# EAGLE design CN-Cape004 (EAGLE 7.2.0)

## Sheet 1 of 5: Spannungsversorgung Verpolungsschutz ? Größe der Sicherung ? 1A oder 3A für Servos?
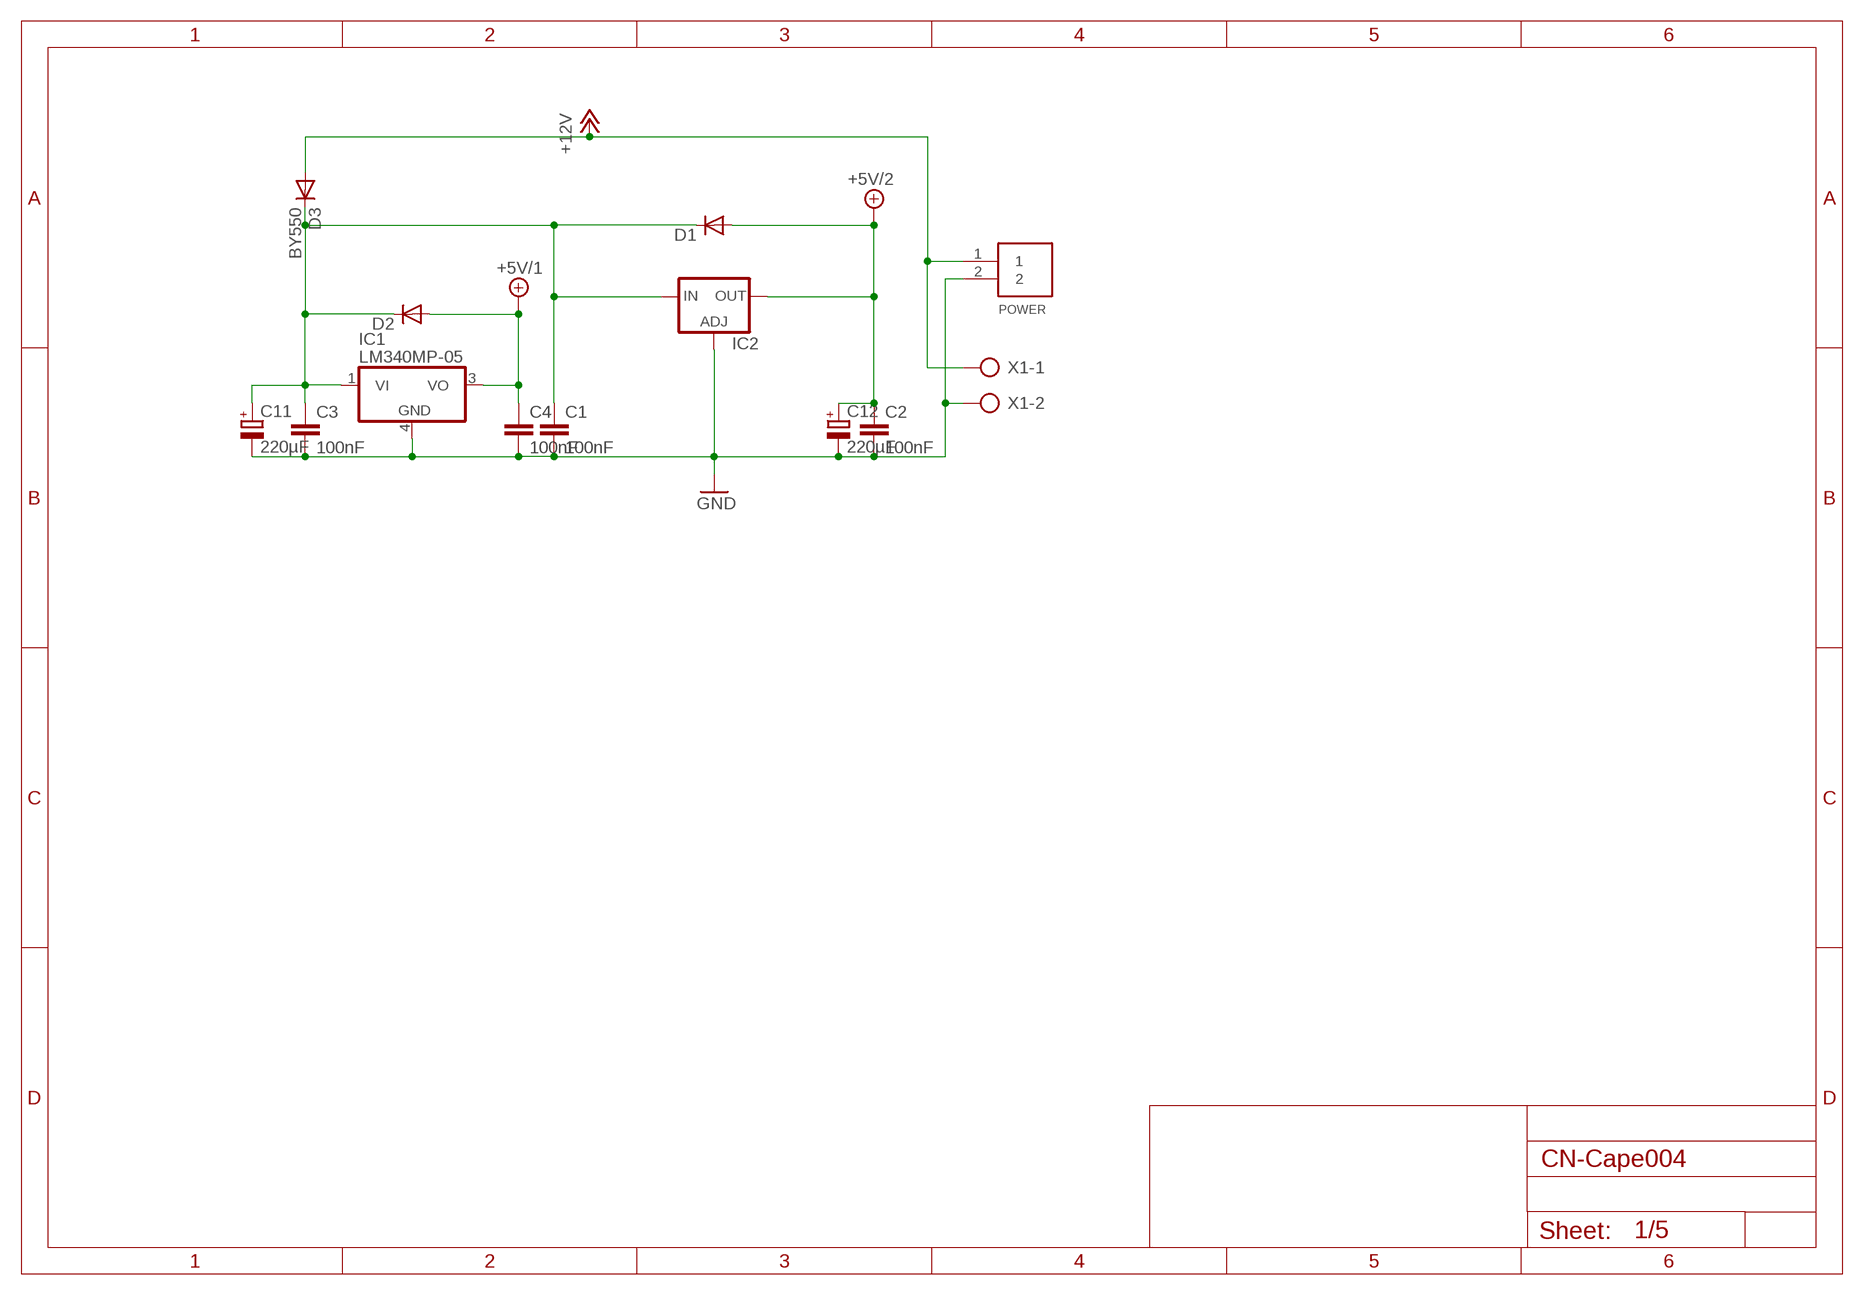
[diagram p0: schematic, sheet 1]

### Parts
C1  100nF  C-EUC0603  [C0603]
C2  100nF  C-EUC0603  [C0603]
C3  100nF  C-EUC0603  [C0603]
C4  100nF  C-EUC0603  [C0603]
C11  220µF  CPOL-EUE3.5-8  [E3,5-8]
C12  220µF  CPOL-EUE3.5-8  [E3,5-8]
D1  DIODE-SOD123  [SOD123]
D2  DIODE-SOD123  [SOD123]
D3  BY550  [DO27-15]
IC1  LM340MP-05  [SOT223]
IC2  LM138-TL  [TO220L1]
POWER  S2PIN  [S2B-EH]
X1  AK500/2-H  [AK500/2-H]

### Nets
12V_FUSED: C1.1 C3.1 C11.+ D1.C D2.C D3.C IC1.1(VI) IC2.3(IN)
+5V/1: C4.1 D2.A IC1.3(VO) ; also sheet 2,3,4,5
+5V/2: C2.1 C12.+ D1.A IC2.2(OUT) ; also sheet 5
+12V: D3.A POWER.1 X1.1
GND: C1.2 C2.2 C3.2 C4.2 C11.- C12.- IC1.4(GND) IC2.1(ADJ) POWER.2 X1.2 ; also sheet 2,3,4,5

## Sheet 2 of 5: BeagleBoard Black Expansion Header
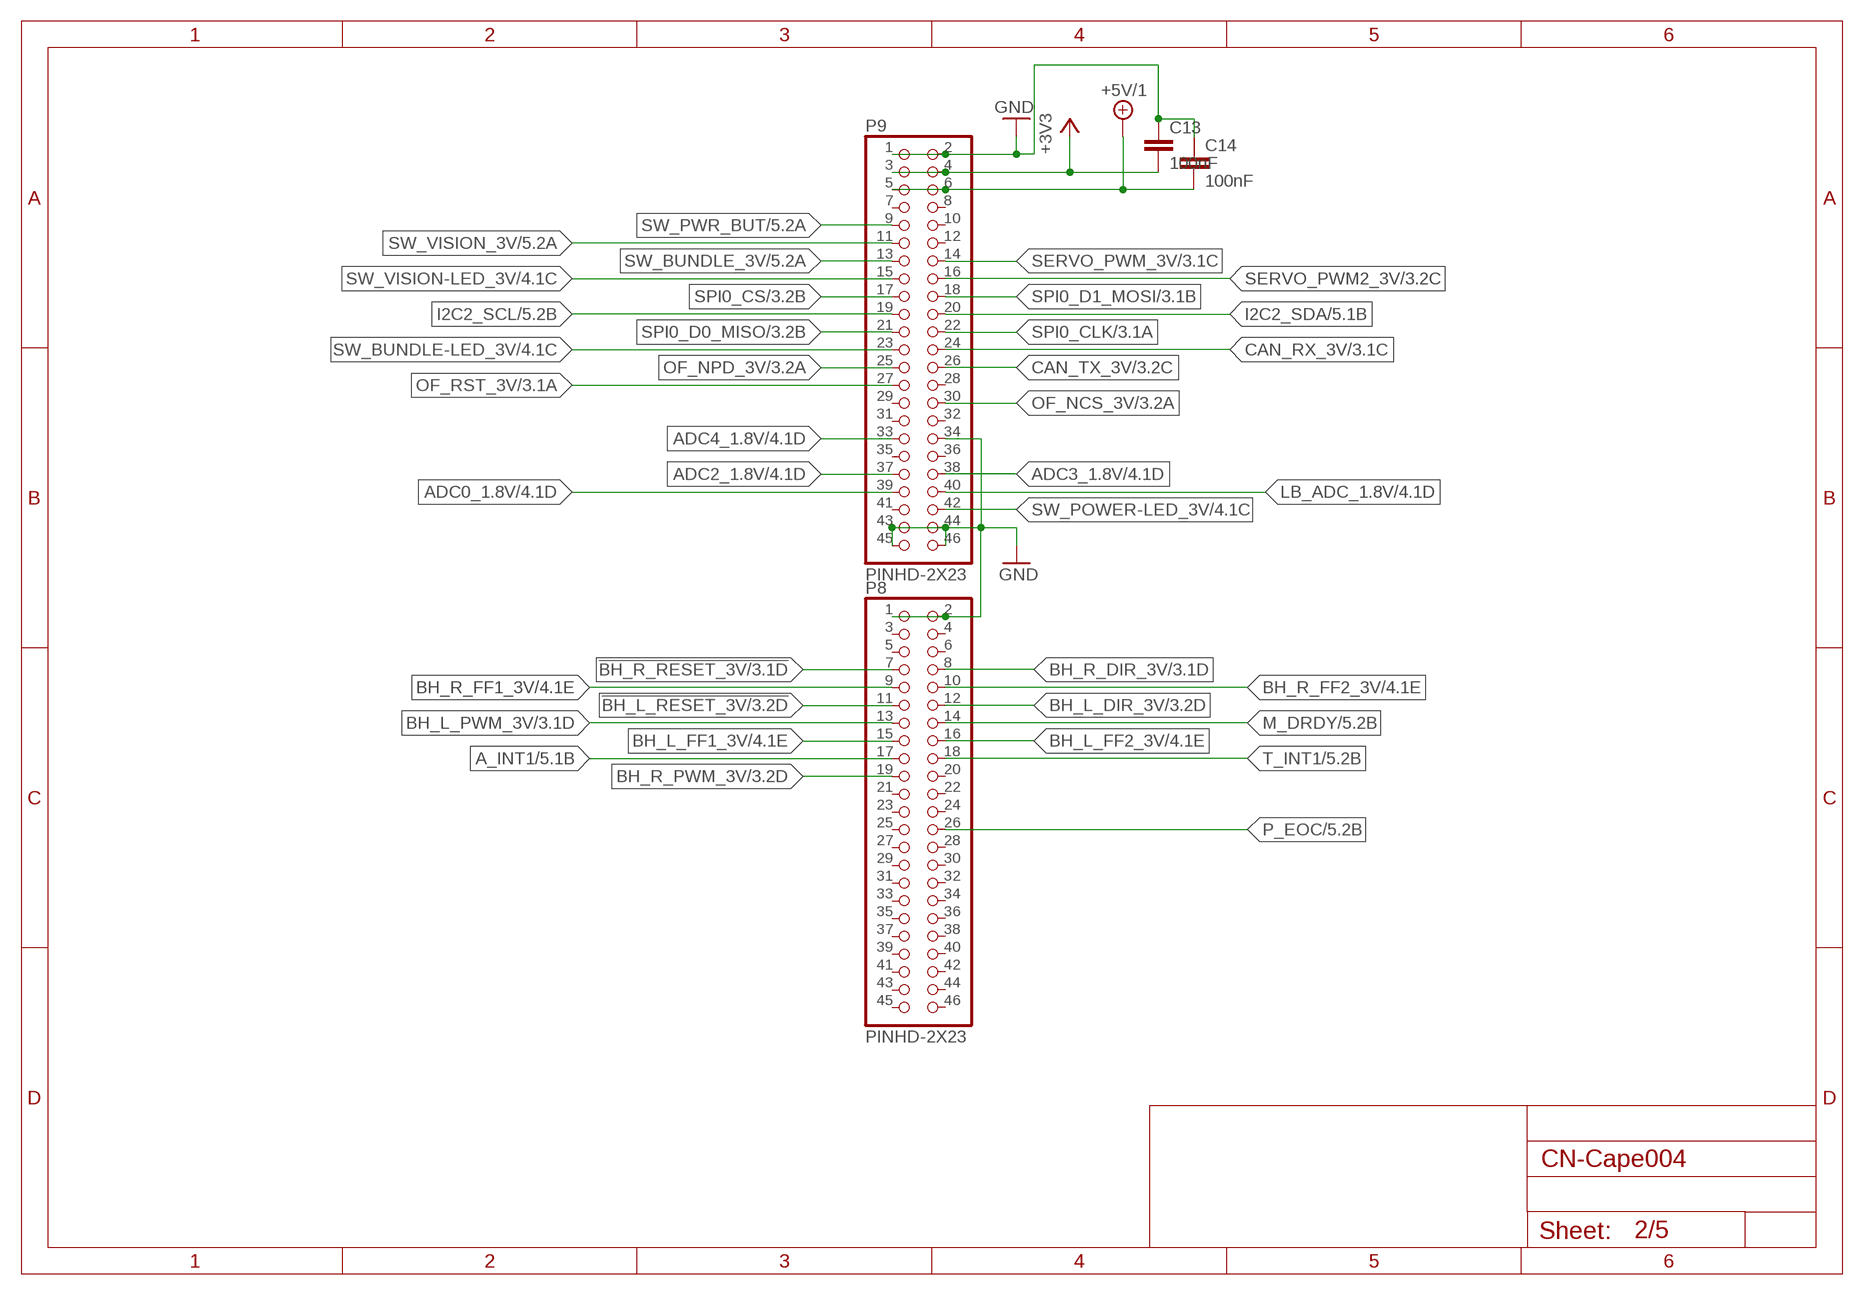
[diagram p1: schematic, sheet 2]

### Parts
C13  100nF  C-EUC0603  [C0603]
C14  100nF  C-EUC0603  [C0603]
P8  PINHD-2X23  [2X23]
P9  PINHD-2X23  [2X23]

### Nets
!BH_L_RESET_3V: P8.11 ; also sheet 3
!BH_R_RESET_3V: P8.7 ; also sheet 3
+3V3: C13.2 P9.3 P9.4 ; also sheet 3,5
+5V/1: C14.2 P9.5 P9.6 ; also sheet 1,3,4,5
A_INT1: P8.17 ; also sheet 5
ADC0_1.8V: P9.39 ; also sheet 4
ADC2_1.8V: P9.37 ; also sheet 4
ADC3_1.8V: P9.38 ; also sheet 4
ADC4_1.8V: P9.33 ; also sheet 4
BH_L_DIR_3V: P8.12 ; also sheet 3
BH_L_FF1_3V: P8.15 ; also sheet 4
BH_L_FF2_3V: P8.16 ; also sheet 4
BH_L_PWM_3V: P8.13 ; also sheet 3
BH_R_DIR_3V: P8.8 ; also sheet 3
BH_R_FF1_3V: P8.9 ; also sheet 4
BH_R_FF2_3V: P8.10 ; also sheet 4
BH_R_PWM_3V: P8.19 ; also sheet 3
CAN_RX_3V: P9.24 ; also sheet 3
CAN_TX_3V: P9.26 ; also sheet 3
GND: C13.1 C14.1 P8.1 P8.2 P9.1 P9.2 P9.34 P9.43 P9.44 P9.45 P9.46 ; also sheet 1,3,4,5
I2C2_SCL: P9.19 ; also sheet 5
I2C2_SDA: P9.20 ; also sheet 5
LB_ADC_1.8V: P9.40 ; also sheet 4
M_DRDY: P8.14 ; also sheet 5
OF_NCS_3V: P9.30 ; also sheet 3
OF_NPD_3V: P9.25 ; also sheet 3
OF_RST_3V: P9.27 ; also sheet 3
P_EOC: P8.26 ; also sheet 5
SERVO_PWM2_3V: P9.16 ; also sheet 3
SERVO_PWM_3V: P9.14 ; also sheet 3
SPI0_CLK: P9.22 ; also sheet 3
SPI0_CS: P9.17 ; also sheet 3
SPI0_D0_MISO: P9.21 ; also sheet 3
SPI0_D1_MOSI: P9.18 ; also sheet 3
SW_BUNDLE-LED_3V: P9.23 ; also sheet 4
SW_BUNDLE_3V: P9.13 ; also sheet 5
SW_POWER-LED_3V: P9.42 ; also sheet 4
SW_PWR_BUT: P9.9 ; also sheet 5
SW_VISION-LED_3V: P9.15 ; also sheet 4
SW_VISION_3V: P9.11 ; also sheet 5
T_INT1: P8.18 ; also sheet 5
Unconnected: P8.3 P8.4 P8.5 P8.6 P8.20 P8.21 P8.22 P8.23 P8.24 P8.25 P8.27 P8.28 P8.29 P8.30 P8.31 P8.32 P8.33 P8.34 P8.35 P8.36 P8.37 P8.38 P8.39 P8.40 P8.41 P8.42 P8.43 P8.44 P8.45 P8.46 P9.7 P9.8 P9.10 P9.12 P9.28 P9.29 P9.31 P9.32 P9.35 P9.36 P9.41

## Sheet 3 of 5: Level Shifter
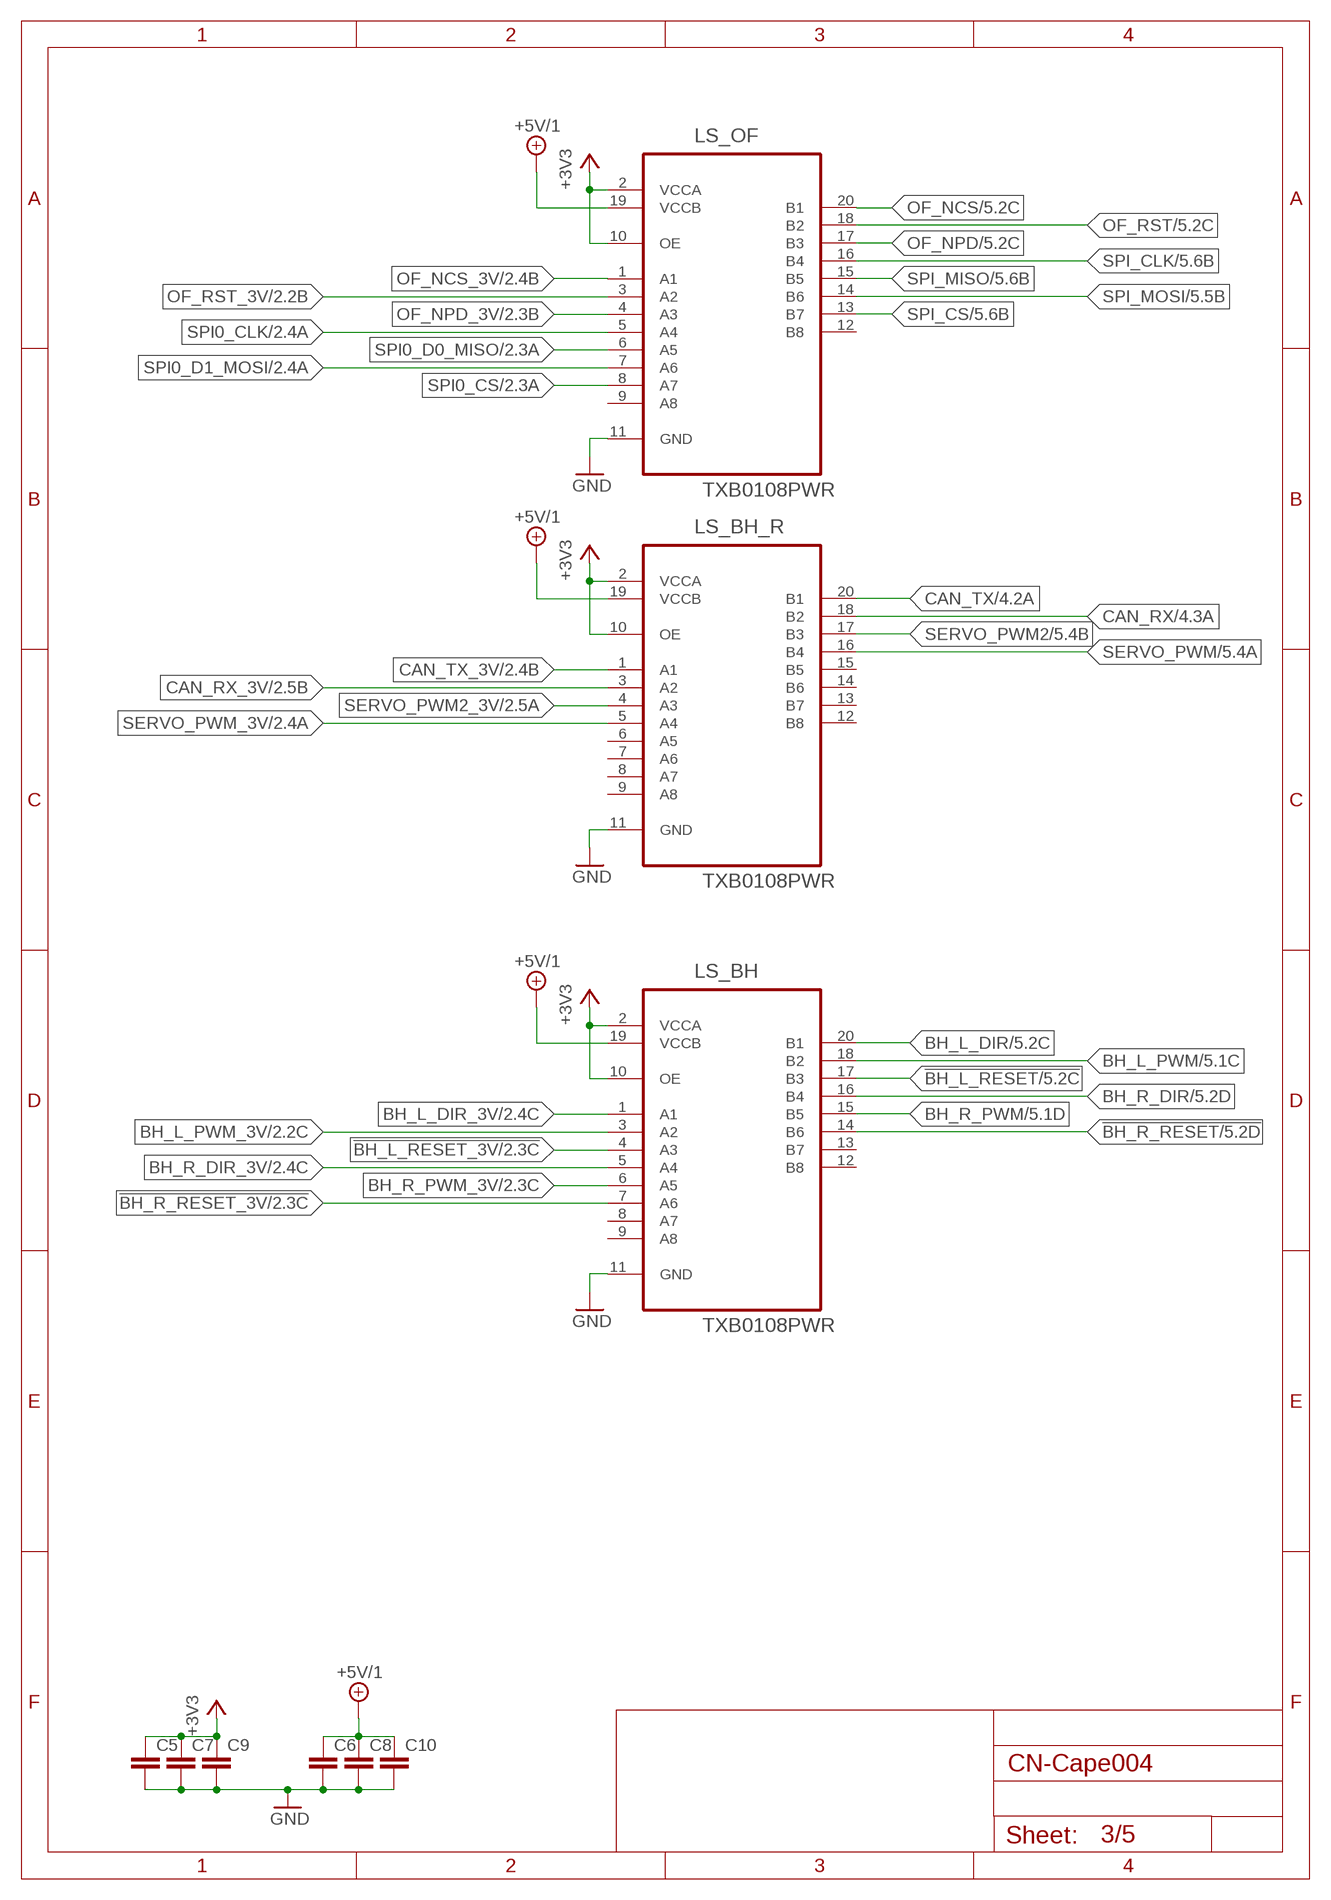
[diagram p2: schematic, sheet 3]

### Parts
C5  C-EUC0603  [C0603]
C6  C-EUC0603  [C0603]
C7  C-EUC0603  [C0603]
C8  C-EUC0603  [C0603]
C9  C-EUC0603  [C0603]
C10  C-EUC0603  [C0603]
LS_BH  TXB0108PWR  [SOP65P640X120-20N]
LS_BH_R  TXB0108PWR  [SOP65P640X120-20N]
LS_OF  TXB0108PWR  [SOP65P640X120-20N]

### Nets
!BH_L_RESET: LS_BH.17(B3) ; also sheet 5
!BH_L_RESET_3V: LS_BH.4(A3) ; also sheet 2
!BH_R_RESET: LS_BH.14(B6) ; also sheet 5
!BH_R_RESET_3V: LS_BH.7(A6) ; also sheet 2
+3V3: C5.1 C7.1 C9.1 LS_BH.2(VCCA) LS_BH.10(OE) LS_BH_R.2(VCCA) LS_BH_R.10(OE) LS_OF.2(VCCA) LS_OF.10(OE) ; also sheet 2,5
+5V/1: C6.1 C8.1 C10.1 LS_BH.19(VCCB) LS_BH_R.19(VCCB) LS_OF.19(VCCB) ; also sheet 1,2,4,5
BH_L_DIR: LS_BH.20(B1) ; also sheet 5
BH_L_DIR_3V: LS_BH.1(A1) ; also sheet 2
BH_L_PWM: LS_BH.18(B2) ; also sheet 5
BH_L_PWM_3V: LS_BH.3(A2) ; also sheet 2
BH_R_DIR: LS_BH.16(B4) ; also sheet 5
BH_R_DIR_3V: LS_BH.5(A4) ; also sheet 2
BH_R_PWM: LS_BH.15(B5) ; also sheet 5
BH_R_PWM_3V: LS_BH.6(A5) ; also sheet 2
CAN_RX: LS_BH_R.18(B2) ; also sheet 4
CAN_RX_3V: LS_BH_R.3(A2) ; also sheet 2
CAN_TX: LS_BH_R.20(B1) ; also sheet 4
CAN_TX_3V: LS_BH_R.1(A1) ; also sheet 2
GND: C5.2 C6.2 C7.2 C8.2 C9.2 C10.2 LS_BH.11(GND) LS_BH_R.11(GND) LS_OF.11(GND) ; also sheet 1,2,4,5
OF_NCS: LS_OF.20(B1) ; also sheet 5
OF_NCS_3V: LS_OF.1(A1) ; also sheet 2
OF_NPD: LS_OF.17(B3) ; also sheet 5
OF_NPD_3V: LS_OF.4(A3) ; also sheet 2
OF_RST: LS_OF.18(B2) ; also sheet 5
OF_RST_3V: LS_OF.3(A2) ; also sheet 2
SERVO_PWM: LS_BH_R.16(B4) ; also sheet 5
SERVO_PWM2: LS_BH_R.17(B3) ; also sheet 5
SERVO_PWM2_3V: LS_BH_R.4(A3) ; also sheet 2
SERVO_PWM_3V: LS_BH_R.5(A4) ; also sheet 2
SPI0_CLK: LS_OF.5(A4) ; also sheet 2
SPI0_CS: LS_OF.8(A7) ; also sheet 2
SPI0_D0_MISO: LS_OF.6(A5) ; also sheet 2
SPI0_D1_MOSI: LS_OF.7(A6) ; also sheet 2
SPI_CLK: LS_OF.16(B4) ; also sheet 5
SPI_CS: LS_OF.13(B7) ; also sheet 5
SPI_MISO: LS_OF.15(B5) ; also sheet 5
SPI_MOSI: LS_OF.14(B6) ; also sheet 5
Unconnected: LS_BH.8(A7) LS_BH.9(A8) LS_BH.12(B8) LS_BH.13(B7) LS_BH_R.6(A5) LS_BH_R.7(A6) LS_BH_R.8(A7) LS_BH_R.9(A8) LS_BH_R.12(B8) LS_BH_R.13(B7) LS_BH_R.14(B6) LS_BH_R.15(B5) LS_OF.9(A8) LS_OF.12(B8)

## Sheet 4 of 5: CAN- Bus & LED Transistoren
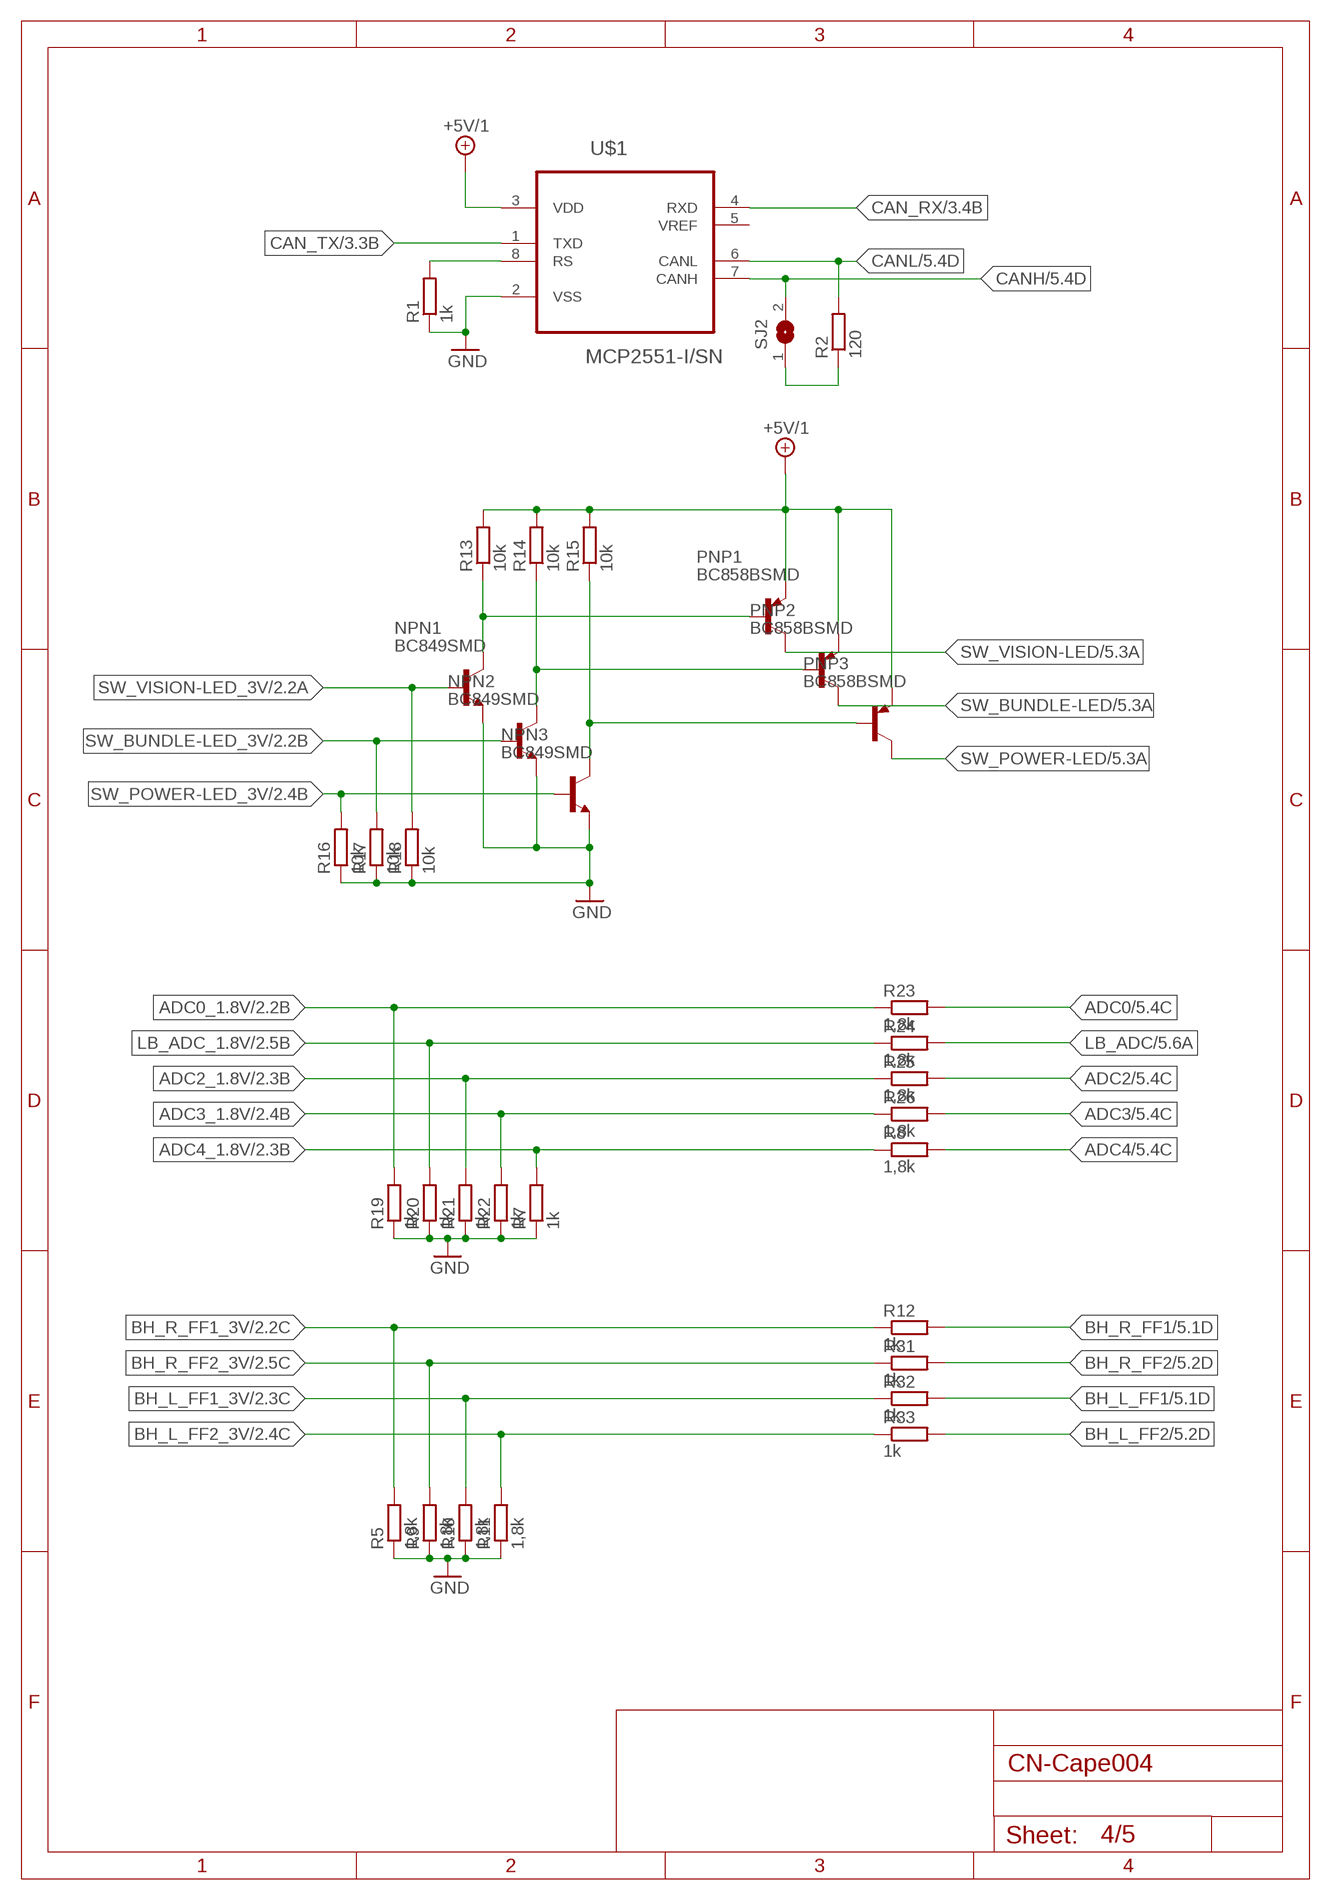
[diagram p3: schematic, sheet 4]

### Parts
NPN1  BC849SMD  [SOT23-BEC]
NPN2  BC849SMD  [SOT23-BEC]
NPN3  BC849SMD  [SOT23-BEC]
PNP1  BC858BSMD  [SOT23-BEC]
PNP2  BC858BSMD  [SOT23-BEC]
PNP3  BC858BSMD  [SOT23-BEC]
R1  1k  R-EU_R0805  [R0805]
R2  120  R-EU_R0805  [R0805]
R5  1,8k  R-EU_R0805  [R0805]
R7  1k  R-EU_R0805  [R0805]
R8  1,8k  R-EU_R0805  [R0805]
R9  1,8k  R-EU_R0805  [R0805]
R10  1,8k  R-EU_R0805  [R0805]
R11  1,8k  R-EU_R0805  [R0805]
R12  1k  R-EU_R0805  [R0805]
R13  10k  R-EU_R0805  [R0805]
R14  10k  R-EU_R0805  [R0805]
R15  10k  R-EU_R0805  [R0805]
R16  10k  R-EU_R0805  [R0805]
R17  10k  R-EU_R0805  [R0805]
R18  10k  R-EU_R0805  [R0805]
R19  1k  R-EU_R0805  [R0805]
R20  1k  R-EU_R0805  [R0805]
R21  1k  R-EU_R0805  [R0805]
R22  1k  R-EU_R0805  [R0805]
R23  1,8k  R-EU_R0805  [R0805]
R24  1,8k  R-EU_R0805  [R0805]
R25  1,8k  R-EU_R0805  [R0805]
R26  1,8k  R-EU_R0805  [R0805]
R31  1k  R-EU_R0805  [R0805]
R32  1k  R-EU_R0805  [R0805]
R33  1k  R-EU_R0805  [R0805]
SJ2  SJ  [SJ]
U$1  MCP2551-I/SN  [SOIC127P600X175-8N]

### Nets
+5V/1: PNP1.E PNP2.E PNP3.E R13.2 R14.2 R15.2 U$1.3(VDD) ; also sheet 1,2,3,5
ADC0: R23.2 ; also sheet 5
ADC0_1.8V: R19.2 R23.1 ; also sheet 2
ADC2: R25.2 ; also sheet 5
ADC2_1.8V: R21.2 R25.1 ; also sheet 2
ADC3: R26.2 ; also sheet 5
ADC3_1.8V: R22.2 R26.1 ; also sheet 2
ADC4: R8.2 ; also sheet 5
ADC4_1.8V: R7.2 R8.1 ; also sheet 2
BH_L_FF1: R32.2 ; also sheet 5
BH_L_FF1_3V: R10.2 R32.1 ; also sheet 2
BH_L_FF2: R33.2 ; also sheet 5
BH_L_FF2_3V: R11.2 R33.1 ; also sheet 2
BH_R_FF1: R12.2 ; also sheet 5
BH_R_FF1_3V: R5.2 R12.1 ; also sheet 2
BH_R_FF2: R31.2 ; also sheet 5
BH_R_FF2_3V: R9.2 R31.1 ; also sheet 2
CAN_RX: U$1.4(RXD) ; also sheet 3
CAN_TX: U$1.1(TXD) ; also sheet 3
CANH: SJ2.2 U$1.7(CANH) ; also sheet 5
CANL: R2.2 U$1.6(CANL) ; also sheet 5
GND: NPN1.E NPN2.E NPN3.E R1.1 R5.1 R7.1 R9.1 R10.1 R11.1 R16.1 R17.1 R18.1 R19.1 R20.1 R21.1 R22.1 U$1.2(VSS) ; also sheet 1,2,3,5
LB_ADC: R24.2 ; also sheet 5
LB_ADC_1.8V: R20.2 R24.1 ; also sheet 2
N$1: NPN1.C PNP1.B R13.1
N$2: NPN2.C PNP2.B R14.1
N$4: NPN3.C PNP3.B R15.1
N$9: R1.2 U$1.8(RS)
N$10: R2.1 SJ2.1
SW_BUNDLE-LED: PNP2.C ; also sheet 5
SW_BUNDLE-LED_3V: NPN2.B R17.2 ; also sheet 2
SW_POWER-LED: PNP3.C ; also sheet 5
SW_POWER-LED_3V: NPN3.B R16.2 ; also sheet 2
SW_VISION-LED: PNP1.C ; also sheet 5
SW_VISION-LED_3V: NPN1.B R18.2 ; also sheet 2
Unconnected: U$1.5(VREF)

## Sheet 5 of 5: Connector
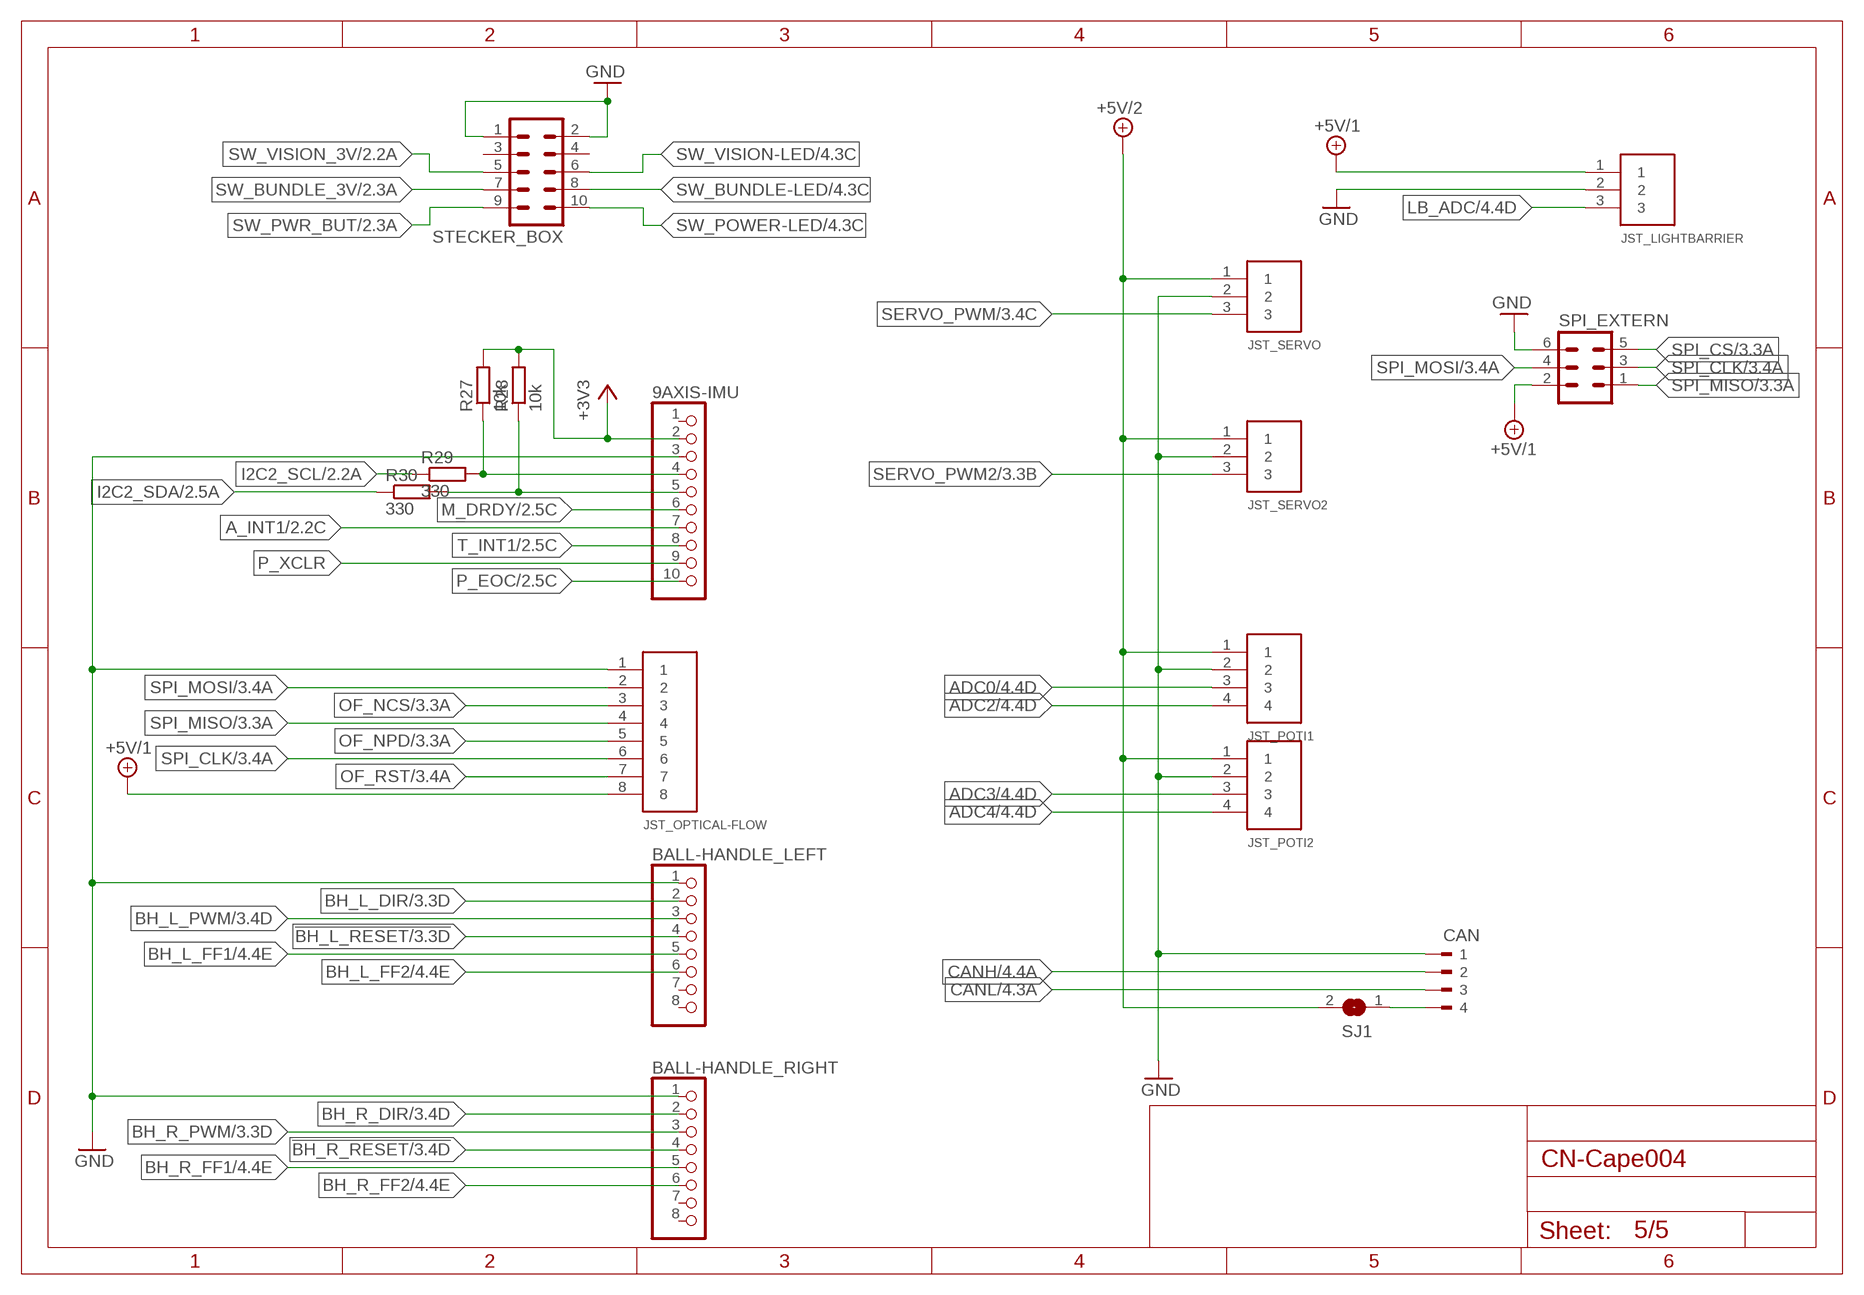
[diagram p4: schematic, sheet 5]

### Parts
9AXIS-IMU  PINHD-1X10  [1X10]
BALL-HANDLE_LEFT  PINHD-1X8  [1X08]
BALL-HANDLE_RIGHT  PINHD-1X8  [1X08]
CAN  90-4  [90-4]
JST_LIGHTBARRIER  S3PIN  [S3B-EH]
JST_OPTICAL-FLOW  S8PIN  [S8B-EH]
JST_POTI1  4PIN  [B4B-EH]
JST_POTI2  4PIN  [B4B-EH]
JST_SERVO  S3PIN  [S3B-EH]
JST_SERVO2  3PIN  [B3B-EH]
R27  10k  R-EU_R0805  [R0805]
R28  10k  R-EU_R0805  [R0805]
R29  330  R-EU_R0805  [R0805]
R30  330  R-EU_R0805  [R0805]
SJ1  SJ  [SJ]
SPI_EXTERN  ML6  [ML6]
STECKER_BOX  ML10  [ML10]

### Nets
5V/2_F&J: CAN.4 SJ1.1
!BH_L_RESET: BALL-HANDLE_LEFT.4 ; also sheet 3
!BH_R_RESET: BALL-HANDLE_RIGHT.4 ; also sheet 3
+3V3: 9AXIS-IMU.2 R27.2 R28.2 ; also sheet 2,3
+5V/1: JST_LIGHTBARRIER.1 JST_OPTICAL-FLOW.8 SPI_EXTERN.2 ; also sheet 1,2,3,4
+5V/2: JST_POTI1.1 JST_POTI2.1 JST_SERVO2.1 JST_SERVO.1 SJ1.2 ; also sheet 1
A_INT1: 9AXIS-IMU.7 ; also sheet 2
ADC0: JST_POTI1.3 ; also sheet 4
ADC2: JST_POTI1.4 ; also sheet 4
ADC3: JST_POTI2.3 ; also sheet 4
ADC4: JST_POTI2.4 ; also sheet 4
BH_L_DIR: BALL-HANDLE_LEFT.2 ; also sheet 3
BH_L_FF1: BALL-HANDLE_LEFT.5 ; also sheet 4
BH_L_FF2: BALL-HANDLE_LEFT.6 ; also sheet 4
BH_L_PWM: BALL-HANDLE_LEFT.3 ; also sheet 3
BH_R_DIR: BALL-HANDLE_RIGHT.2 ; also sheet 3
BH_R_FF1: BALL-HANDLE_RIGHT.5 ; also sheet 4
BH_R_FF2: BALL-HANDLE_RIGHT.6 ; also sheet 4
BH_R_PWM: BALL-HANDLE_RIGHT.3 ; also sheet 3
CANH: CAN.2 ; also sheet 4
CANL: CAN.3 ; also sheet 4
GND: 9AXIS-IMU.3 BALL-HANDLE_LEFT.1 BALL-HANDLE_RIGHT.1 CAN.1 JST_LIGHTBARRIER.2 JST_OPTICAL-FLOW.1 JST_POTI1.2 JST_POTI2.2 JST_SERVO2.2 JST_SERVO.2 SPI_EXTERN.6 STECKER_BOX.1 STECKER_BOX.2 ; also sheet 1,2,3,4
I2C2_SCL: R29.1 ; also sheet 2
I2C2_SDA: R30.1 ; also sheet 2
LB_ADC: JST_LIGHTBARRIER.3 ; also sheet 4
M_DRDY: 9AXIS-IMU.6 ; also sheet 2
OF_NCS: JST_OPTICAL-FLOW.3 ; also sheet 3
OF_NPD: JST_OPTICAL-FLOW.5 ; also sheet 3
OF_RST: JST_OPTICAL-FLOW.7 ; also sheet 3
P_EOC: 9AXIS-IMU.10 ; also sheet 2
P_XCLR: 9AXIS-IMU.9
SCL: 9AXIS-IMU.4 R27.1 R29.2
SDA: 9AXIS-IMU.5 R28.1 R30.2
SERVO_PWM: JST_SERVO.3 ; also sheet 3
SERVO_PWM2: JST_SERVO2.3 ; also sheet 3
SPI_CLK: JST_OPTICAL-FLOW.6 SPI_EXTERN.3 ; also sheet 3
SPI_CS: SPI_EXTERN.5 ; also sheet 3
SPI_MISO: JST_OPTICAL-FLOW.4 SPI_EXTERN.1 ; also sheet 3
SPI_MOSI: JST_OPTICAL-FLOW.2 SPI_EXTERN.4 ; also sheet 3
SW_BUNDLE-LED: STECKER_BOX.8 ; also sheet 4
SW_BUNDLE_3V: STECKER_BOX.7 ; also sheet 2
SW_POWER-LED: STECKER_BOX.10 ; also sheet 4
SW_PWR_BUT: STECKER_BOX.9 ; also sheet 2
SW_VISION-LED: STECKER_BOX.6 ; also sheet 4
SW_VISION_3V: STECKER_BOX.5 ; also sheet 2
T_INT1: 9AXIS-IMU.8 ; also sheet 2
Unconnected: 9AXIS-IMU.1 BALL-HANDLE_LEFT.7 BALL-HANDLE_LEFT.8 BALL-HANDLE_RIGHT.7 BALL-HANDLE_RIGHT.8 STECKER_BOX.3 STECKER_BOX.4

## Library data of the parts
9AXIS-IMU = pinhead:PINHD-1X10: PIN HEADER
BALL-HANDLE_LEFT BALL-HANDLE_RIGHT = pinhead:PINHD-1X8: PIN HEADER
C1-C10 C13 C14 = rcl:C-EU: CAPACITOR, European symbol
C11 C12 = rcl:CPOL-EU: POLARIZED CAPACITOR, European symbol
CAN = con-weidmueller-sl35:90-4: WEIDMUELLER CLAMP CONNECTOR
D1 D2 = diode:DIODE-: DIODE; REICHELT: SD 101BW
D3 = diode:BY550: DIODE Si200 V, 5 A
IC1 = linear:LM340?-*: Positive VOLTAGE REGULATOR Source: http://cache.national.com/ds/LM/LM340.pdf
IC2 = v-reg:LM138-TL: VOLTAGE REGULATOR
JST_LIGHTBARRIER JST_SERVO = jst_eh:S3PIN
JST_OPTICAL-FLOW = jst_eh:S8PIN
JST_POTI1 JST_POTI2 = jst_eh:4PIN
JST_SERVO2 = jst_eh:3PIN
LS_BH LS_BH_R LS_OF = TI-TXB0108PWR:TXB0108PWR: 8-BIT BIDIRECTIONAL VOLTAGE-LEVEL TRANSLATOR; MPN: TXB0108PWR; OC_FARNELL: 1494945; OC_NEWARK: 27M1151; PACKAGE: TSSOP-20; SUPPLIER: Texas Instruments
NPN1-NPN3 = transistor-npn:BC849*: NPN Transistor
P8 P9 = pinhead-2x23:PINHD-2X23
PNP1-PNP3 = transistor-pnp:BC858*: PNP Transistror
POWER = jst_eh:S2PIN
R1 R2 R5 R7-R33 = rcl:R-EU_: RESISTOR, European symbol
SJ1 SJ2 = jumper:SJ: SMD solder JUMPER
SPI_EXTERN = con-ml:ML6: HARTING
STECKER_BOX = con-ml:ML10: HARTING
U$1 = Microchip-MCP2551-I_SN:MCP2551-I/SN: High-Speed CAN Transceiver; MPN: MCP2551-I/SN; OC_FARNELL: 9758569; OC_NEWARK: 69K7604; PACKAGE: SOIC-8; SUPPLIER: Microchip
X1 = con-ptr500:AK500/2-H: CONNECTOR Aug. 2004 / PTR Meßtechnik: Die Bezeichnung der Serie AK505 wurde geändert. Es handelt sich hierbei um AK500 in horizontaler Ausführung.

## Board
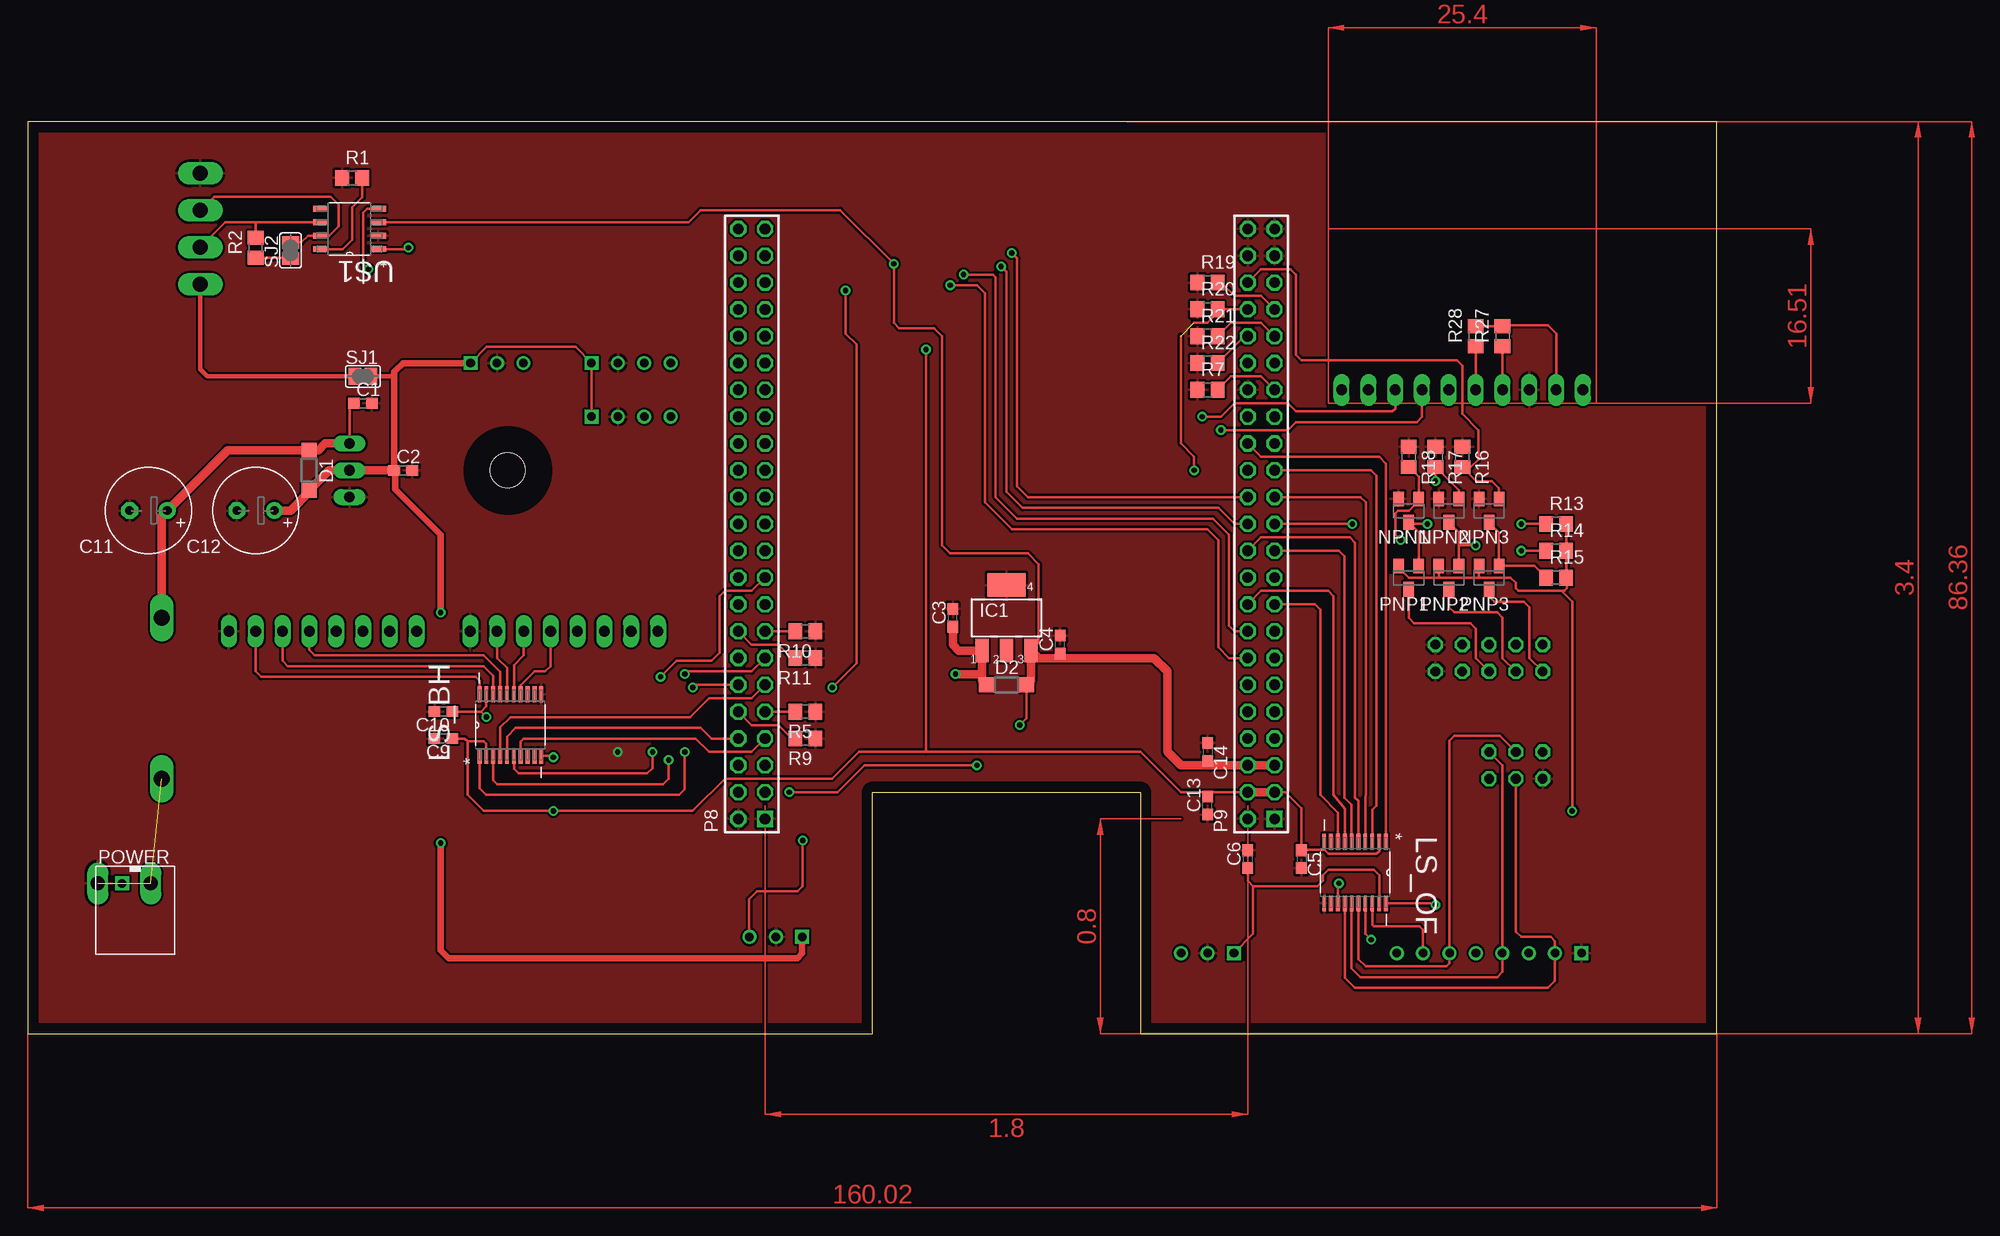
[diagram p5: board, top side]
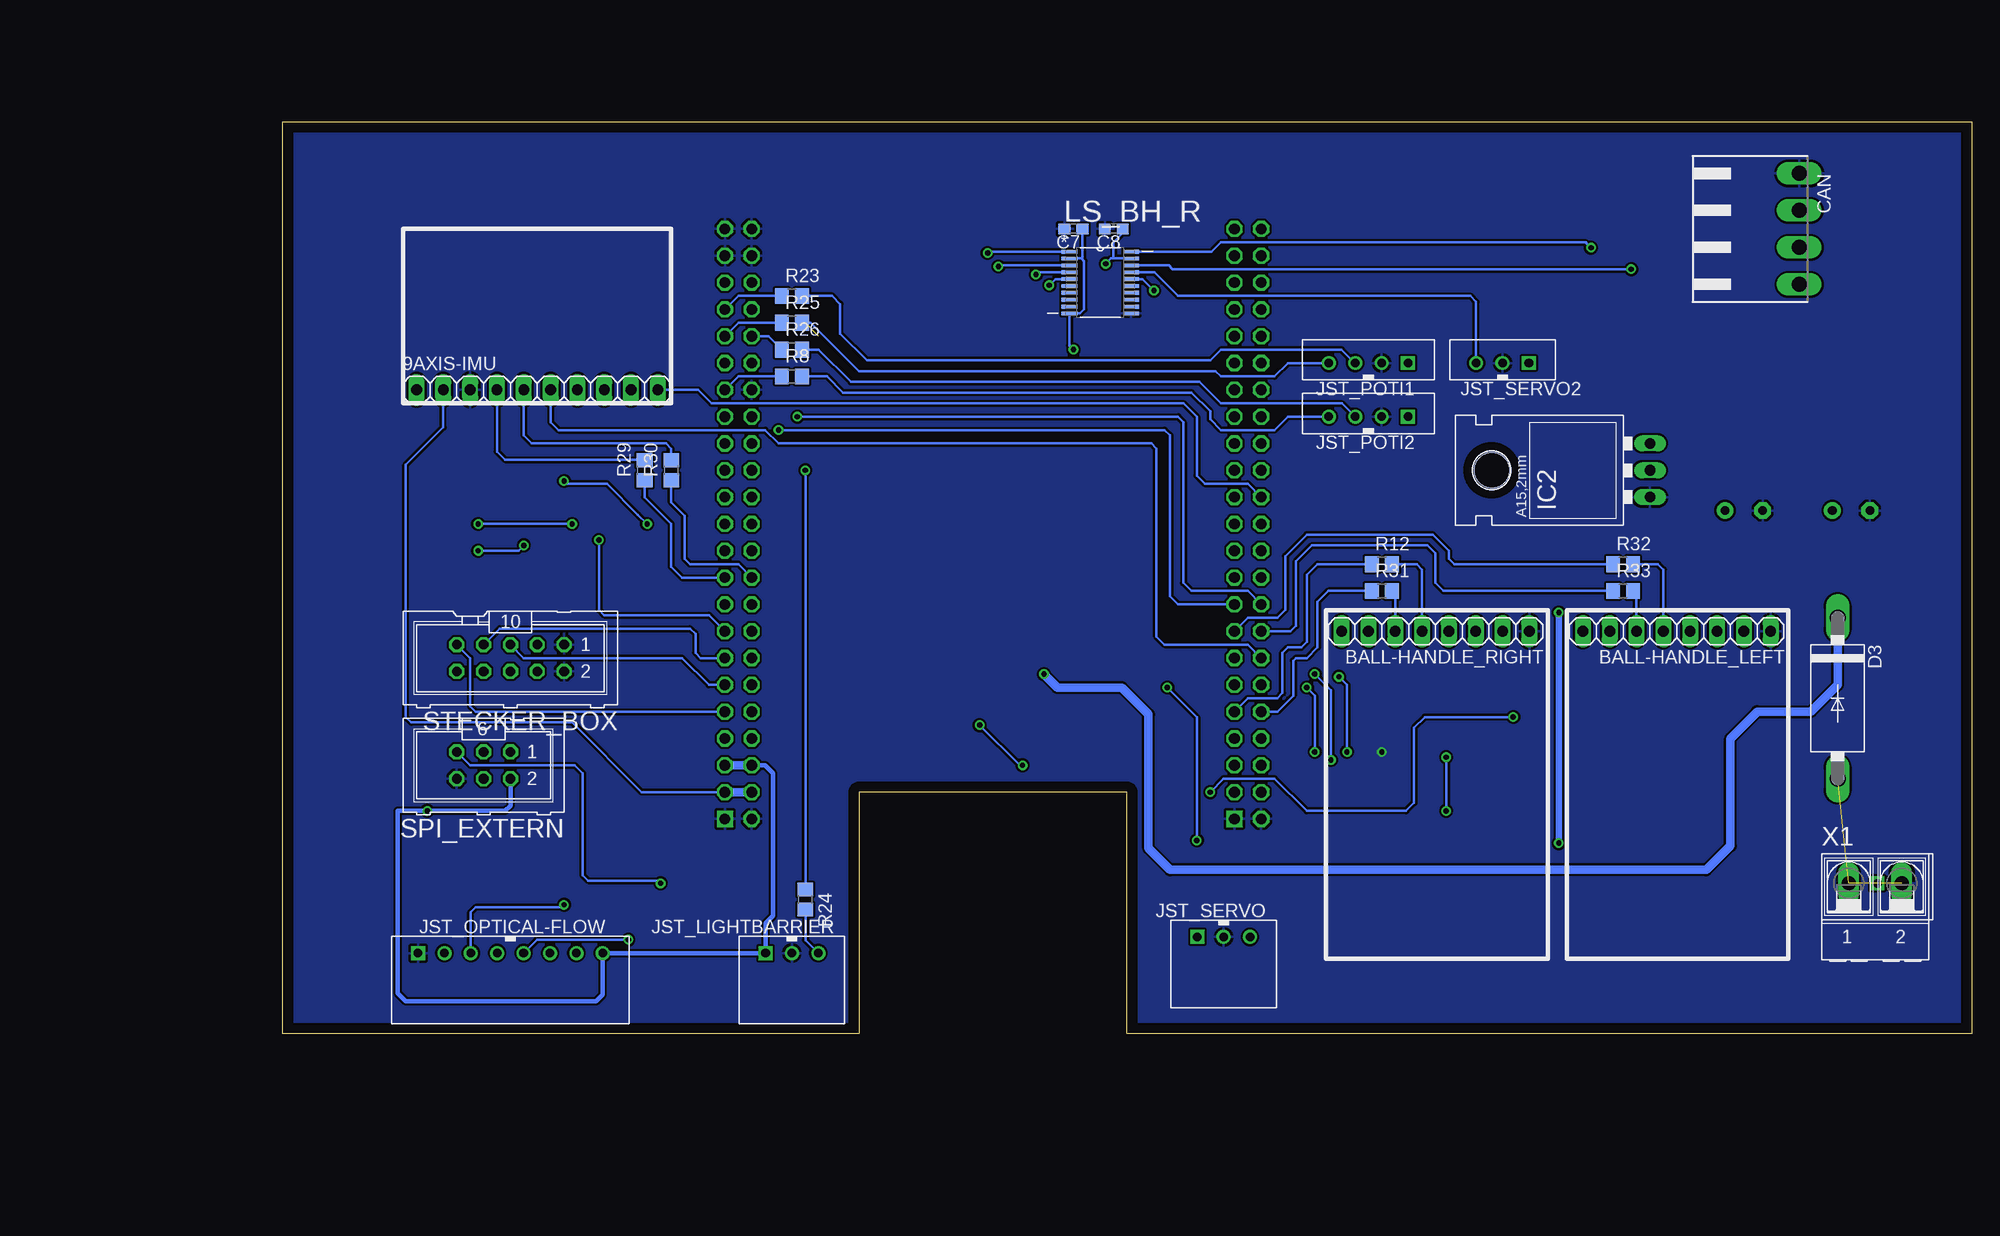
[diagram p6: board, bottom side, seen from below]

Size 160.02 x 86.36 mm. Coordinates in mm from the lower left corner, seen from the top.
Outline: 0,0 80.01,0 80.01,22.86 105.41,22.86 105.41,0 160.02,0 160.02,86.36 0,86.36 0,0
Copper layers (1*16): Top 0.035mm / dielectric 1.5mm / Bottom 0.035mm
Design rules "default": minimum track width 10mil, minimum drill 24mil, track to track 8mil, track to pad 8mil, pad to pad 8mil, via to via 8mil, smd to smd 8mil, copper to edge 40mil, drill to drill 8mil, minimum pad ring 10mil, minimum via ring 8mil, stop-mask expansion 4mil, vias tented up to drill 0mil, thermal gap 10mil

### Footprints (pad centres in the part's own frame; a part is rotated, then mirrored left to right if it is on the bottom)
1X10 = drill 1.016 long: 1 -11.43,0; 2 -8.89,0; 3 -6.35,0; 4 -3.81,0; 5 -1.27,0; 6 1.27,0; 7 3.81,0; 8 6.35,0; 9 8.89,0; 10 11.43,0
1X08 = drill 1.016 long: 1 -8.89,0; 2 -6.35,0; 3 -3.81,0; 4 -1.27,0; 5 1.27,0; 6 3.81,0; 7 6.35,0; 8 8.89,0
C0603 = smd 1.1 x 1: 1 -0.85,0; 2 0.85,0
E3,5-8 = drill 0.813 pad 1.6: + -1.778,0 | drill 0.813 pad 1.6 octagon: - 1.778,0
90-4 = drill 1.422 long: 1 -5.25,5.25; 2 -1.75,5.25; 3 1.75,5.25; 4 5.25,5.25
SOD123 = smd 1.4 x 1.4: A 1.9,0; C -1.9,0
DO27-15 = drill 1.499 long: A 7.62,0; C -7.62,0
SOT223 = smd 1.219 x 2.235: 1 -2.311,-3.099; 2 0,-3.099; 3 2.311,-3.099 | smd 3.6 x 2.2: 4 0,3.099
TO220L1 = drill 1.016 long: 1 -2.54,-3.81; 2 0,-3.81; 3 2.54,-3.81 | hole 3.302: 0,11.176
S3B-EH = drill 0.813 square: 1 2.5,0 | drill 0.813: 2 0,0; 3 -2.5,0
S8B-EH = drill 0.813 square: 1 8.75,0 | drill 0.813: 2 6.25,0; 3 3.75,0; 4 1.25,0; 5 -1.25,0; 6 -3.75,0; 7 -6.25,0; 8 -8.75,0
B4B-EH = drill 0.813 square: 1 3.75,0 | drill 0.813: 2 1.25,0; 3 -1.25,0; 4 -3.75,0
B3B-EH = drill 0.813 square: 1 2.5,0 | drill 0.813: 2 0,0; 3 -2.5,0
SOP65P640X120-20N = smd 1.473 x 0.356: 1 -2.921,2.921; 2 -2.921,2.286; 3 -2.921,1.626; 4 -2.921,0.965; 5 -2.921,0.33; 6 -2.921,-0.33; 7 -2.921,-0.965; 8 -2.921,-1.626; 9 -2.921,-2.286; 10 -2.921,-2.921; 11 2.921,-2.921; 12 2.921,-2.286; 13 2.921,-1.626; 14 2.921,-0.965; 15 2.921,-0.33; 16 2.921,0.33; 17 2.921,0.965; 18 2.921,1.626; 19 2.921,2.286; 20 2.921,2.921
SOT23-BEC = smd 1 x 1.4: B -0.95,-1.1; C 0,1.1; E 0.95,-1.1
2X23 = drill 1.016 square: 1 -26.67,-1.27 | drill 1.016 octagon: 2 -26.67,1.27; 3 -24.13,-1.27; 4 -24.13,1.27; 5 -21.59,-1.27; 6 -21.59,1.27; 7 -19.05,-1.27; 8 -19.05,1.27; 9 -16.51,-1.27; 10 -16.51,1.27; 11 -13.97,-1.27; 12 -13.97,1.27; 13 -11.43,-1.27; 14 -11.43,1.27; 15 -8.89,-1.27; 16 -8.89,1.27; 17 -6.35,-1.27; 18 -6.35,1.27; 19 -3.81,-1.27; 20 -3.81,1.27; 21 -1.27,-1.27; 22 -1.27,1.27; 23 1.27,-1.27; 24 1.27,1.27; 25 3.81,-1.27; 26 3.81,1.27; 27 6.35,-1.27; 28 6.35,1.27; 29 8.89,-1.27; 30 8.89,1.27; 31 11.43,-1.27; 32 11.43,1.27; 33 13.97,-1.27; 34 13.97,1.27; 35 16.51,-1.27; 36 16.51,1.27; 37 19.05,-1.27; 38 19.05,1.27; 39 21.59,-1.27; 40 21.59,1.27; 41 24.13,-1.27; 42 24.13,1.27; 43 26.67,-1.27; 44 26.67,1.27; 45 29.21,-1.27; 46 29.21,1.27
S2B-EH = drill 0.813 square: 1 2.5,0 | drill 0.813: 2 0,0
R0805 = smd 1.3 x 1.5: 1 -0.95,0; 2 0.95,0
SJ = smd 1.168 x 1.6: 1 -0.762,0; 2 0.762,0
ML6 = drill 0.914 octagon: 1 -2.54,-1.27; 2 -2.54,1.27; 3 0,-1.27; 4 0,1.27; 5 2.54,-1.27; 6 2.54,1.27
ML10 = drill 0.914 octagon: 1 -5.08,-1.27; 2 -5.08,1.27; 3 -2.54,-1.27; 4 -2.54,1.27; 5 0,-1.27; 6 0,1.27; 7 2.54,-1.27; 8 2.54,1.27; 9 5.08,-1.27; 10 5.08,1.27
SOIC127P600X175-8N = smd 1.473 x 0.559: 1 -2.718,1.905; 2 -2.718,0.635; 3 -2.718,-0.635; 4 -2.718,-1.905; 5 2.718,-1.905; 6 2.718,-0.635; 7 2.718,0.635; 8 2.718,1.905
AK500/2-H = drill 1.321 long: 1 -2.515,0; 2 2.515,0

### Placement (x,y rotation side)
9AXIS-IMU  135.89,60.96 0 bottom
BALL-HANDLE_LEFT  27.94,38.1 180 bottom
BALL-HANDLE_RIGHT  50.8,38.1 180 bottom
C1  31.75,59.69 0 top
C2  35.56,53.34 0 top
C3  87.63,39.37 90 top
C4  97.79,36.83 90 top
C5  120.65,16.51 270 top
C6  115.57,16.51 90 top
C7  85.09,76.2 180 bottom
C8  81.28,76.2 180 bottom
C9  39.37,27.94 180 top
C10  39.37,30.48 180 top
C11  11.43,49.53 180 top
C12  21.59,49.53 180 top
C13  111.76,21.59 90 top
C14  111.76,26.67 270 top
CAN  21.59,76.2 270 bottom
D1  26.67,53.34 270 top
D2  92.71,33.02 0 top
D3  12.7,31.75 270 bottom
IC1  92.71,39.37 0 top
IC2  34.29,53.34 90 bottom
JST_LIGHTBARRIER  111.76,7.62 180 bottom
JST_OPTICAL-FLOW  138.43,7.62 180 bottom
JST_POTI1  57.15,63.5 0 bottom
JST_POTI2  57.15,58.42 0 bottom
JST_SERVO  70.87,9.14 180 bottom
JST_SERVO2  44.45,63.5 0 bottom
LS_BH  45.72,29.21 90 top
LS_BH_R  82.55,71.12 0 bottom
LS_OF  125.73,15.24 270 top
NPN1  130.81,49.53 180 top
NPN2  134.62,49.53 180 top
NPN3  138.43,49.53 180 top
P8  68.58,46.99 90 top
P9  116.84,46.99 90 top
PNP1  130.81,43.18 180 top
PNP2  134.62,43.18 180 top
PNP3  138.43,43.18 180 top
POWER  11.43,14.22 180 top
R1  30.73,81.03 0 top
R2  21.59,74.42 90 top
R5  73.66,30.48 180 top
R7  111.76,60.96 0 top
R8  111.76,62.23 0 bottom
R9  73.66,27.94 180 top
R10  73.66,38.1 180 top
R11  73.66,35.56 180 top
R12  55.88,44.45 0 bottom
R13  144.78,48.26 0 top
R14  144.78,45.72 0 top
R15  144.78,43.18 0 top
R16  135.89,54.61 270 top
R17  133.35,54.61 270 top
R18  130.81,54.61 270 top
R19  111.76,71.12 0 top
R20  111.76,68.58 0 top
R21  111.76,66.04 0 top
R22  111.76,63.5 0 top
R23  111.76,69.85 0 bottom
R24  110.49,12.7 270 bottom
R25  111.76,67.31 0 bottom
R26  111.76,64.77 0 bottom
R27  139.7,66.04 90 top
R28  137.16,66.04 90 top
R29  125.73,53.34 90 bottom
R30  123.19,53.34 90 bottom
R31  55.88,41.91 0 bottom
R32  33.02,44.45 0 bottom
R33  33.02,41.91 0 bottom
SJ1  31.75,62.23 0 top
SJ2  24.89,74.17 90 top
SPI_EXTERN  140.97,25.4 180 bottom
STECKER_BOX  138.43,35.56 180 bottom
U$1  30.48,76.2 180 top
X1  9.14,14.22 0 bottom

### Tracks (layer width: path | path; a pad name or v marks a point on that pad's centre or on a via)
5V/2_F&J
  Top 0.406: SJ1.1 17.02,62.23 16.34,62.91 CAN.4
12V_FUSED  (via drill 0.5)
  Top 0.254: IC2.3 30.48,59.27 C1.1
  Top 0.813: 90.4,34.29 IC1.1 88.19,36.27 87.63,36.83 C3.1 | 90.4,34.29 90.4,33.43 D2.C | v87.88,34.04 90.14,34.04 90.4,34.29 | D3.C 12.7,49.02 C11.+ 18.92,55.24 D1.C 27.55,55.24 28.19,55.88 IC2.3
  Bottom 0.813: v87.88,34.04 86.61,32.77 80.52,32.77 77.98,30.23 77.98,17.53 75.95,15.49 25.15,15.49 22.86,17.78 22.86,27.94 20.32,30.48 15.24,30.48 12.7,33.02 D3.C
!BH_L_RESET
  Top 0.254: BALL-HANDLE_LEFT.4 26.67,36.32 27.18,35.81 43.18,35.81 44.76,34.24 LS_BH.17
!BH_L_RESET_3V
  Top 0.254: P8.11 68.58,31.75 64.52,31.75 62.74,29.97 45.72,29.97 44.76,29.01 LS_BH.4
!BH_R_RESET
  Top 0.254: LS_BH.14 46.69,32.97 48.01,34.29 49.02,34.29 49.53,34.8 BALL-HANDLE_RIGHT.4
!BH_R_RESET_3V
  Top 0.254: P8.7 68.58,26.67 64.52,26.67 63.25,27.94 46.99,27.94 46.69,27.64 LS_BH.7
+3V3  (via drill 0.5)
  Top 0.254: LS_OF.2 128.02,17.27 127.76,17.02 123.19,17.02 122.81,17.4 | LS_OF.10 122.81,17.4 | 122.81,17.4 120.69,17.4 C5.1 120.65,21.34 119.13,22.86 P9.3 111.76,22.86 | 9AXIS-IMU.2 144.78,66.29 144.02,67.06 139.77,67.06 R27.2 R28.2 | 111.76,22.86 109.22,22.86 105.41,26.67 85.09,26.67 | 85.09,26.67 78.74,26.67 76.2,24.13 66.04,24.13 62.99,21.08 v49.78,21.08 43.18,21.08 41.66,22.61 41.66,27.69 | v85.09,64.77 85.09,26.67 | C13.2 111.76,22.86 | 41.66,27.69 41.4,27.94 C9.1 | 41.66,27.69 43.18,27.69 43.43,27.43 LS_BH.2 | LS_BH.10 49.66,26.29 v49.78,26.16
  Top 0.813: P9.4 P9.3
  Bottom 0.254: P9.3 125.98,22.86 132.59,29.46 147.83,29.46 148.34,29.97 148.34,53.85 144.78,57.4 9AXIS-IMU.2 | v85.09,64.77 85.47,65.15 LS_BH_R.10 84.45,68.2 84.07,68.58 84.07,73.15 84.33,73.41 | 84.33,73.41 LS_BH_R.2 | C7.1 84.24,73.49 84.33,73.41 | v49.78,26.16 v49.78,21.08
  Bottom 0.813: P9.4 P9.3
+5V/1  (via drill 0.5)
  Top 0.254: LS_OF.19 128.02,14.99 127.51,15.49 123.19,15.49 122.68,14.99 122.68,14.48 122.17,13.97 116.08,13.97 | 116.08,13.97 115.57,14.48 C6.1 | 116.08,13.97 116.08,9.44 JST_LIGHTBARRIER.1 | R13.2 R14.2 R15.2 145.8,43.11 145.8,42.16 145.54,41.91 145.29,41.91 | PNP1.E 129.86,44.13 130.81,43.18 133.6,43.18 | 133.6,43.18 137.41,43.18 | 137.41,43.18 140.46,43.18 140.97,42.67 140.97,42.16 141.22,41.91 145.29,41.91 | 145.29,41.91 146.3,40.89 v146.3,21.08 | PNP2.E 133.67,43.25 133.6,43.18 | PNP3.E 137.48,43.25 137.41,43.18 | LS_BH.19 43.43,30.99 42.93,30.48 | 42.93,30.48 C10.1 | C14.2 111.76,25.65 112.01,25.4 | IC1.3 95.76,37.01 95.76,44.45 94.74,45.47 87.38,45.47 86.61,46.23 86.61,66.04 85.85,66.8 82.55,66.8 82.04,67.31 v82.04,72.9 76.96,77.98 63.75,77.98 62.61,76.83 U$1.3 | D2.A 94.61,29.84 v93.98,29.21 | 42.93,30.48 v43.43,29.97 | v72.14,22.86 76.71,22.86 79.25,25.4 v89.92,25.4
  Top 0.813: P9.6 P9.5 112.01,25.4 109.22,25.4 107.95,26.67 107.95,34.29 106.68,35.56 97.79,35.56 | 97.79,35.56 95.73,35.56 IC1.3 95.02,33.43 D2.A | C4.1 97.79,35.56
  Bottom 0.254: LS_BH_R.19 81.28,73.41 | 81.28,73.41 81.53,73.41 v82.04,72.9 | v93.98,29.21 90.17,25.4 v89.92,25.4 | v43.43,29.97 51.82,29.97 52.83,28.96 52.83,21.84 53.59,21.08 62.99,21.08 66.04,24.13 70.87,24.13 v72.14,22.86 | C8.1 80.43,75.78 81.28,74.93 81.28,73.41
  Bottom 0.406: P9.6 114.3,25.4 113.54,24.64 113.54,11.18 114.26,10.45 JST_LIGHTBARRIER.1 JST_OPTICAL-FLOW.8 129.68,3.67 130.3,3.05 148.34,3.05 149.1,3.81 149.1,21.08 v146.3,21.08 138.94,21.08 138.43,21.59 SPI_EXTERN.2
  Bottom 0.813: P9.6 P9.5
+5V/2  (via drill 0.5)
  Top 0.254: JST_POTI2.1 JST_POTI1.1 51.88,65.02 43.47,65.02 JST_SERVO2.1
  Top 0.406: SJ1.2 34.71,62.23
  Top 0.61: JST_SERVO.1 73.37,7.58 72.9,7.11 39.88,7.11 39.12,7.87 v39.12,18.03 | v39.12,39.88 39.12,47.24 34.8,51.56 34.8,53.25 C2.1 34.71,62.23 34.71,62.65 35.56,63.5 JST_SERVO2.1
  Top 0.813: C12.+ 24.89,49.53 26.67,51.31 D1.A 28.57,53.34 IC2.2 C2.1
  Bottom 0.61: v39.12,18.03 v39.12,39.88
+12V  (2 unrouted)
A_INT1  (via drill 0.5)
  Top 0.254: 9AXIS-IMU.7 132.08,58.42 131.57,57.91 120.14,57.91 119.38,57.15 v113.03,57.15
  Bottom 0.254: v113.03,57.15 76.45,57.15 75.95,56.64 75.95,41.4 75.18,40.64 P8.17
ADC0
  Bottom 0.254: JST_POTI1.3 58.42,63.5 59.69,64.77 71.12,64.77 72.14,63.75 104.65,63.75 107.19,66.29 107.19,69.09 107.95,69.85 R23.2
ADC0_1.8V
  Top 0.254: R19.2 113.03,71.12 114.3,69.85 116.84,69.85 P9.39
  Bottom 0.254: R23.1 116.84,69.85 P9.39
ADC2
  Bottom 0.254: JST_POTI1.4 64.77,63.5 66.04,62.23 71.12,62.23 71.63,62.74 105.41,62.74 109.98,67.31 R25.2
ADC2_1.8V
  Top 0.254: R21.2 113.98,67.31 116.84,67.31 P9.37
  Bottom 0.254: R25.1 116.84,67.31 P9.37
ADC3
  Bottom 0.254: R26.2 109.22,64.77 106.17,61.72 73.15,61.72 71.12,59.69 59.67,59.69 JST_POTI2.3
ADC3_1.8V
  Top 0.254: R22.2 115.25,66.04 P9.38
  Bottom 0.254: R26.1 113.98,66.04 P9.38
ADC4
  Bottom 0.254: JST_POTI2.4 64.77,58.42 66.04,57.15 71.12,57.15 72.14,58.17 72.14,58.93 73.91,60.71 106.93,60.71 108.46,62.23 R8.2
ADC4_1.8V
  Top 0.254: R7.2 113.98,62.23 116.84,62.23 P9.33
  Bottom 0.254: R8.1 116.84,62.23 P9.33
BH_L_DIR
  Top 0.254: LS_BH.20 42.8,33.4 42.42,33.78 22.1,33.78 21.59,34.29 BALL-HANDLE_LEFT.2
BH_L_DIR_3V  (via drill 0.5)
  Top 0.254: P8.12 63.25,33.02 v62.99,32.77 | LS_BH.1 42.8,23.24 43.43,22.61 61.72,22.61 62.23,23.11 v62.23,26.67
  Bottom 0.254: v62.99,32.77 62.23,32 v62.23,26.67
BH_L_FF1
  Bottom 0.254: BALL-HANDLE_LEFT.5 29.21,43.94 29.72,44.45 R32.2
BH_L_FF1_3V
  Top 0.254: P8.15 R10.2
  Bottom 0.254: R32.1 49.02,44.45 49.53,44.96 49.53,45.72 51.05,47.24 62.99,47.24 65.02,45.21 65.02,40.13 65.79,39.37 68.58,39.37 P8.15
BH_L_FF2
  Bottom 0.254: BALL-HANDLE_LEFT.6 31.75,41.59 R33.2
BH_L_FF2_3V
  Top 0.254: R11.2 72.39,35.56 71.12,36.83 68.58,36.83 P8.16
  Bottom 0.254: P8.16 64.52,38.1 64.01,38.61 64.01,44.7 62.48,46.23 51.56,46.23 50.8,45.47 50.8,42.67 50.04,41.91 R33.1
BH_L_PWM
  Top 0.254: LS_BH.18 44.09,33.88 43.18,34.8 24.64,34.8 24.13,35.31 BALL-HANDLE_LEFT.3
BH_L_PWM_3V  (via drill 0.5)
  Top 0.254: P8.13 68.58,34.29 62.48,34.29 v62.23,34.04 | LS_BH.3 44.09,23.98 44.45,23.62 60.2,23.62 60.71,24.13 v60.71,25.91
  Bottom 0.254: v62.23,34.04 60.71,32.51 v60.71,25.91
BH_R_DIR
  Top 0.254: LS_BH.16 45.39,34.62 44.45,35.56 BALL-HANDLE_RIGHT.2
BH_R_DIR_3V
  Top 0.254: P8.8 64.77,27.94 63.75,28.96 46.23,28.96 45.39,28.12 LS_BH.5
BH_R_FF1
  Bottom 0.254: BALL-HANDLE_RIGHT.5 52.07,43.94 52.58,44.45 R12.2
BH_R_FF1_3V
  Top 0.254: R5.2 P8.9
  Bottom 0.254: P8.9 68.58,31.75 65.79,31.75 65.28,32.26 65.28,36.07 64.77,36.58 63.5,36.58 62.99,37.08 62.99,43.43 61.98,44.45 R12.1
BH_R_FF2
  Bottom 0.254: BALL-HANDLE_RIGHT.6 54.61,41.59 R31.2
BH_R_FF2_3V
  Top 0.254: R9.2 72.39,27.94 71.12,29.21 68.58,29.21 P8.10
  Bottom 0.254: R31.1 60.96,41.91 61.98,40.89 61.98,36.58 62.99,35.56 64.01,35.56 64.26,35.31 64.26,32 65.79,30.48 P8.10
BH_R_PWM
  Top 0.254: LS_BH.15 46.05,34.87 46.99,35.81 BALL-HANDLE_RIGHT.3
BH_R_PWM_3V  (via drill 0.5)
  Top 0.254: P8.19 68.58,41.91 66.04,41.91 65.53,41.4 65.53,36.07 64.77,35.31 61.47,35.31 v59.94,33.78 | v59.18,26.67 59.18,25.15 58.67,24.64 46.48,24.64 46.05,25.07 LS_BH.6
  Bottom 0.254: v59.94,33.78 59.18,33.02 v59.18,26.67
CAN_RX  (via drill 0.5)
  Top 0.254: U$1.4 32.13,78.11 31.75,77.72 31.75,72.9 v32.26,72.39
  Bottom 0.254: LS_BH_R.18 76.05,72.75 75.69,72.39 v32.26,72.39
CAN_RX_3V  (via drill 0.5)
  Top 0.254: P9.24 114.3,48.26 112.78,49.78 94.23,49.78 92.71,51.31 92.71,72.14 92.58,72.26 v92.2,72.64
  Bottom 0.254: LS_BH_R.3 92.1,72.75 v92.2,72.64
CAN_TX  (via drill 0.5)
  Top 0.254: U$1.1 35.94,74.3 v36.07,74.42
  Bottom 0.254: LS_BH_R.20 72.01,74.04 71.12,74.93 36.58,74.93 36.45,74.8 v36.07,74.42
CAN_TX_3V  (via drill 0.5)
  Top 0.254: P9.26 94.74,50.8 93.73,51.82 93.73,73.41 93.6,73.53 v93.22,73.91
  Bottom 0.254: LS_BH_R.1 93.09,74.04 v93.22,73.91
CANH
  Top 0.254: CAN.2 17.64,79.25 28.7,79.25 29.46,78.49 29.46,76.45 28.57,75.56 U$1.7 26.54,75.56 25.91,74.93 SJ2.2
CANL
  Top 0.254: U$1.6 21.59,76.83 | 21.59,76.83 18.73,76.83 CAN.3 | R2.2 21.59,76.83
GND  (via drill 0.5)  (1 unrouted)
  other vias: 55.88,26.67
  pour Bottom: 0,0 160.02,0 160.02,86.36 0,86.36
  pour Top: 0,0 160.02,0 160.02,86.36 0,86.36
I2C2_SCL
  Bottom 0.254: R29.1 125.73,50.8 123.19,48.26 123.19,44.2 122.17,43.18 P9.19
I2C2_SDA
  Bottom 0.254: P9.20 116.84,44.45 121.41,44.45 121.92,44.96 121.92,49.02 123.19,50.29 R30.1
LB_ADC
  Bottom 0.254: R24.2 110.49,8.85 JST_LIGHTBARRIER.3
LB_ADC_1.8V  (via drill 0.5)  (1 unrouted)
  Top 0.254: P9.40 R20.2 112.71,68.26 111.76,67.31 110.49,67.31 | v110.49,53.34 110.49,54.61 109.22,55.88 109.22,66.04
  Bottom 0.254: R24.1 v110.49,53.34
M_DRDY
  Bottom 0.254: 9AXIS-IMU.6 134.62,57.91 133.86,57.15 114.3,57.15 113.03,55.88 77.72,55.88 77.22,55.37 77.22,37.59 76.45,36.83 68.58,36.83 P8.14
N$1  (via drill 0.5)
  Top 0.254: PNP1.B 131.76,47.48 NPN1.C 130.98,48.26 v132.59,48.26 | R13.1 v141.48,48.26
  Bottom 0.254: v141.48,48.26 v132.59,48.26
N$2  (via drill 0.5)
  Top 0.254: PNP2.B 135.57,46.23 | 135.57,46.23 135.57,47.48 NPN2.C | R14.1 v141.48,45.72 | v137.16,46.23 135.57,46.23
  Bottom 0.254: v141.48,45.72 137.67,45.72 v137.16,46.23
N$4
  Top 0.254: NPN3.C 139.38,47.48 PNP3.B 142.73,44.28 R15.1
N$9
  Top 0.254: U$1.8 29.84,74.3 30.73,75.18 30.73,78.23 31.68,79.18 R1.2
N$10
  Top 0.254: R2.1 24.83,73.47 SJ2.1
OF_NCS  (via drill 0.5)
  Top 0.254: LS_OF.20 133.22,12.32 v133.35,12.19
  Bottom 0.254: v133.35,12.19 133.6,11.94 141.73,11.94 142.18,11.49 JST_OPTICAL-FLOW.3
OF_NCS_3V
  Top 0.254: P9.30 116.84,54.61 128.02,54.61 128.65,53.98 LS_OF.1
OF_NPD  (via drill 0.5)
  Top 0.254: LS_OF.17 126.69,9.45 v127.25,8.89
  Bottom 0.254: v127.25,8.89 135.91,8.89 JST_OPTICAL-FLOW.5
OF_NPD_3V
  Top 0.254: LS_OF.4 126.69,22.4 126.75,22.61 126.75,50.29 126.24,50.8 P9.25
OF_RST
  Top 0.254: LS_OF.18 127.36,10.31 127.51,10.16 131.83,10.16 132.18,9.81 JST_OPTICAL-FLOW.7
OF_RST_3V
  Top 0.254: LS_OF.3 127.36,21.18 127.76,21.59 127.76,52.83 127.25,53.34 P9.27
P_EOC
  Bottom 0.254: 9AXIS-IMU.10 120.65,60.96 119.38,59.69 74.68,59.69 73.41,58.42 73.41,52.83 72.64,52.07 68.58,52.07 P8.26
SCL
  Top 0.254: R27.1 9AXIS-IMU.4
  Bottom 0.254: 9AXIS-IMU.4 139.7,55.12 138.94,54.36 125.8,54.36 R29.2
SDA
  Top 0.254: R28.1 9AXIS-IMU.5
  Bottom 0.254: 9AXIS-IMU.5 137.16,56.64 136.4,55.88 123.7,55.88 123.19,55.37 R30.2
SERVO_PWM  (via drill 0.5)
  Top 0.254: v77.47,70.36 77.47,66.29 78.49,65.28 78.49,35.05 v76.2,32.77 | v73.41,18.29 73.41,13.97 72.9,13.46 69.09,13.46 68.33,12.7 68.33,9.18 JST_SERVO.3
  Bottom 0.254: LS_BH_R.16 78.56,71.45 v77.47,70.36 | v76.2,32.77 73.41,29.97 v73.41,18.29
SERVO_PWM2
  Bottom 0.254: LS_BH_R.17 77.42,72.08 75.18,69.85 47.5,69.85 46.95,69.3 JST_SERVO2.3
SERVO_PWM2_3V  (via drill 0.5)
  Top 0.254: P9.16 114.3,38.1 113.79,38.61 113.79,47.24 112.27,48.77 93.73,48.77 91.69,50.8 91.69,71.63 91.44,71.88 v88.65,71.88
  Bottom 0.254: LS_BH_R.4 88.44,72.08 v88.65,71.88
SERVO_PWM_3V  (via drill 0.5)
  Top 0.254: P9.14 113.79,35.56 112.78,36.58 112.78,46.74 111.76,47.75 93.22,47.75 90.68,50.29 90.68,70.1 89.92,70.87 v87.38,70.87
  Bottom 0.254: LS_BH_R.5 86.79,71.45 v87.38,70.87
SPI0_CLK
  Top 0.254: LS_OF.5 126.06,22.02 125.73,22.35 125.73,46.48 125.22,46.99 116.84,46.99 P9.22
SPI0_CS
  Top 0.254: LS_OF.8 124.1,20.93 122.43,22.61 122.43,40.13 121.92,40.64 P9.17
SPI0_D0_MISO
  Top 0.254: LS_OF.6 125.4,21.67 124.71,22.35 124.71,45.21 124.21,45.72 P9.21
SPI0_D1_MOSI
  Top 0.254: LS_OF.7 124.77,21.29 123.7,22.61 123.7,41.4 123.19,41.91 116.84,41.91 P9.18
SPI_CLK
  Top 0.254: SPI_EXTERN.3 139.45,28.19 135.13,28.19 134.68,27.75 JST_OPTICAL-FLOW.6 134.68,6.66 134.37,6.35 126.75,6.35 126.06,7.04 LS_OF.16
SPI_CS  (via drill 0.5)
  Top 0.254: LS_OF.13 124.1,14.12 v124.21,14.22
  Bottom 0.254: SPI_EXTERN.5 142.24,25.4 132.33,25.4 131.57,24.64 131.57,14.99 131.06,14.48 124.46,14.48 v124.21,14.22
SPI_MISO
  Top 0.254: SPI_EXTERN.1 139.7,25.4 139.7,7.64 JST_OPTICAL-FLOW.4 139.7,7.6 139.7,5.84 139.19,5.33 126.24,5.33 125.4,6.17 LS_OF.15
SPI_MOSI
  Top 0.254: SPI_EXTERN.4 140.97,9.65 141.48,9.14 144.27,9.14 144.68,8.74 JST_OPTICAL-FLOW.2 144.68,4.98 144.02,4.32 125.73,4.32 124.77,5.28 LS_OF.14
SW_BUNDLE-LED
  Top 0.254: STECKER_BOX.8 139.7,35.56 139.7,39.37 139.19,39.88 135.13,39.88 134.62,40.39 PNP2.C
SW_BUNDLE-LED_3V  (via drill 0.5)
  Top 0.254: NPN2.B 135.57,51.44 R17.2 v133.35,52.32 | P9.23 v125.48,48.26
  Bottom 0.254: v133.35,52.32 133.1,52.07 129.29,52.07 126.36,49.15 v125.48,48.26
SW_BUNDLE_3V
  Bottom 0.254: STECKER_BOX.7 139.45,38.35 121.41,38.35 120.9,37.85 120.9,36.07 120.4,35.56 P9.13
SW_POWER-LED
  Top 0.254: STECKER_BOX.10 142.24,35.56 142.24,40.39 141.73,40.89 138.94,40.89 138.43,41.4 PNP3.C
SW_POWER-LED_3V
  Top 0.254: NPN3.B 139.38,51.63 138.68,52.32 137.23,52.32 R16.2 136.72,53.66 137.41,54.36 137.41,57.15 135.89,58.67 135.89,63.25 135.38,63.75 120.65,63.75 120.14,64.26 120.14,71.88 119.63,72.39 116.84,72.39 P9.42
SW_PWR_BUT
  Bottom 0.254: STECKER_BOX.9 142.24,35.56 142.24,30.99 141.73,30.48 P9.9
SW_VISION-LED
  Top 0.254: STECKER_BOX.6 137.16,35.56 137.16,38.35 136.65,38.86 131.32,38.86 130.81,39.37 PNP1.C
SW_VISION-LED_3V  (via drill 0.5)
  Top 0.254: R18.2 131.76,52.71 NPN1.B 131.76,50.48 130.81,49.53 129.79,49.53 129.54,49.28 129.54,47.24 v130.05,46.74
  Bottom 0.254: v130.05,46.74 130.05,40.13 129.54,39.62 119.63,39.62 P9.15
SW_VISION_3V
  Bottom 0.254: P9.11 119.63,33.02 122.17,35.56 137.16,35.56 STECKER_BOX.5
T_INT1  (via drill 0.5)
  Top 0.254: 9AXIS-IMU.8 129.54,59.18 129.29,58.93 120.14,58.93 119.38,59.69 114.3,59.69 113.03,58.42 v111.25,58.42
  Bottom 0.254: v111.25,58.42 75.18,58.42 74.68,57.91 74.68,42.67 73.91,41.91 68.58,41.91 P8.18
(copper drawn outside any net)
  shapes: Top area x7